# Altium project 16SoundsUSB.PrjPCB (part 1 of 2)
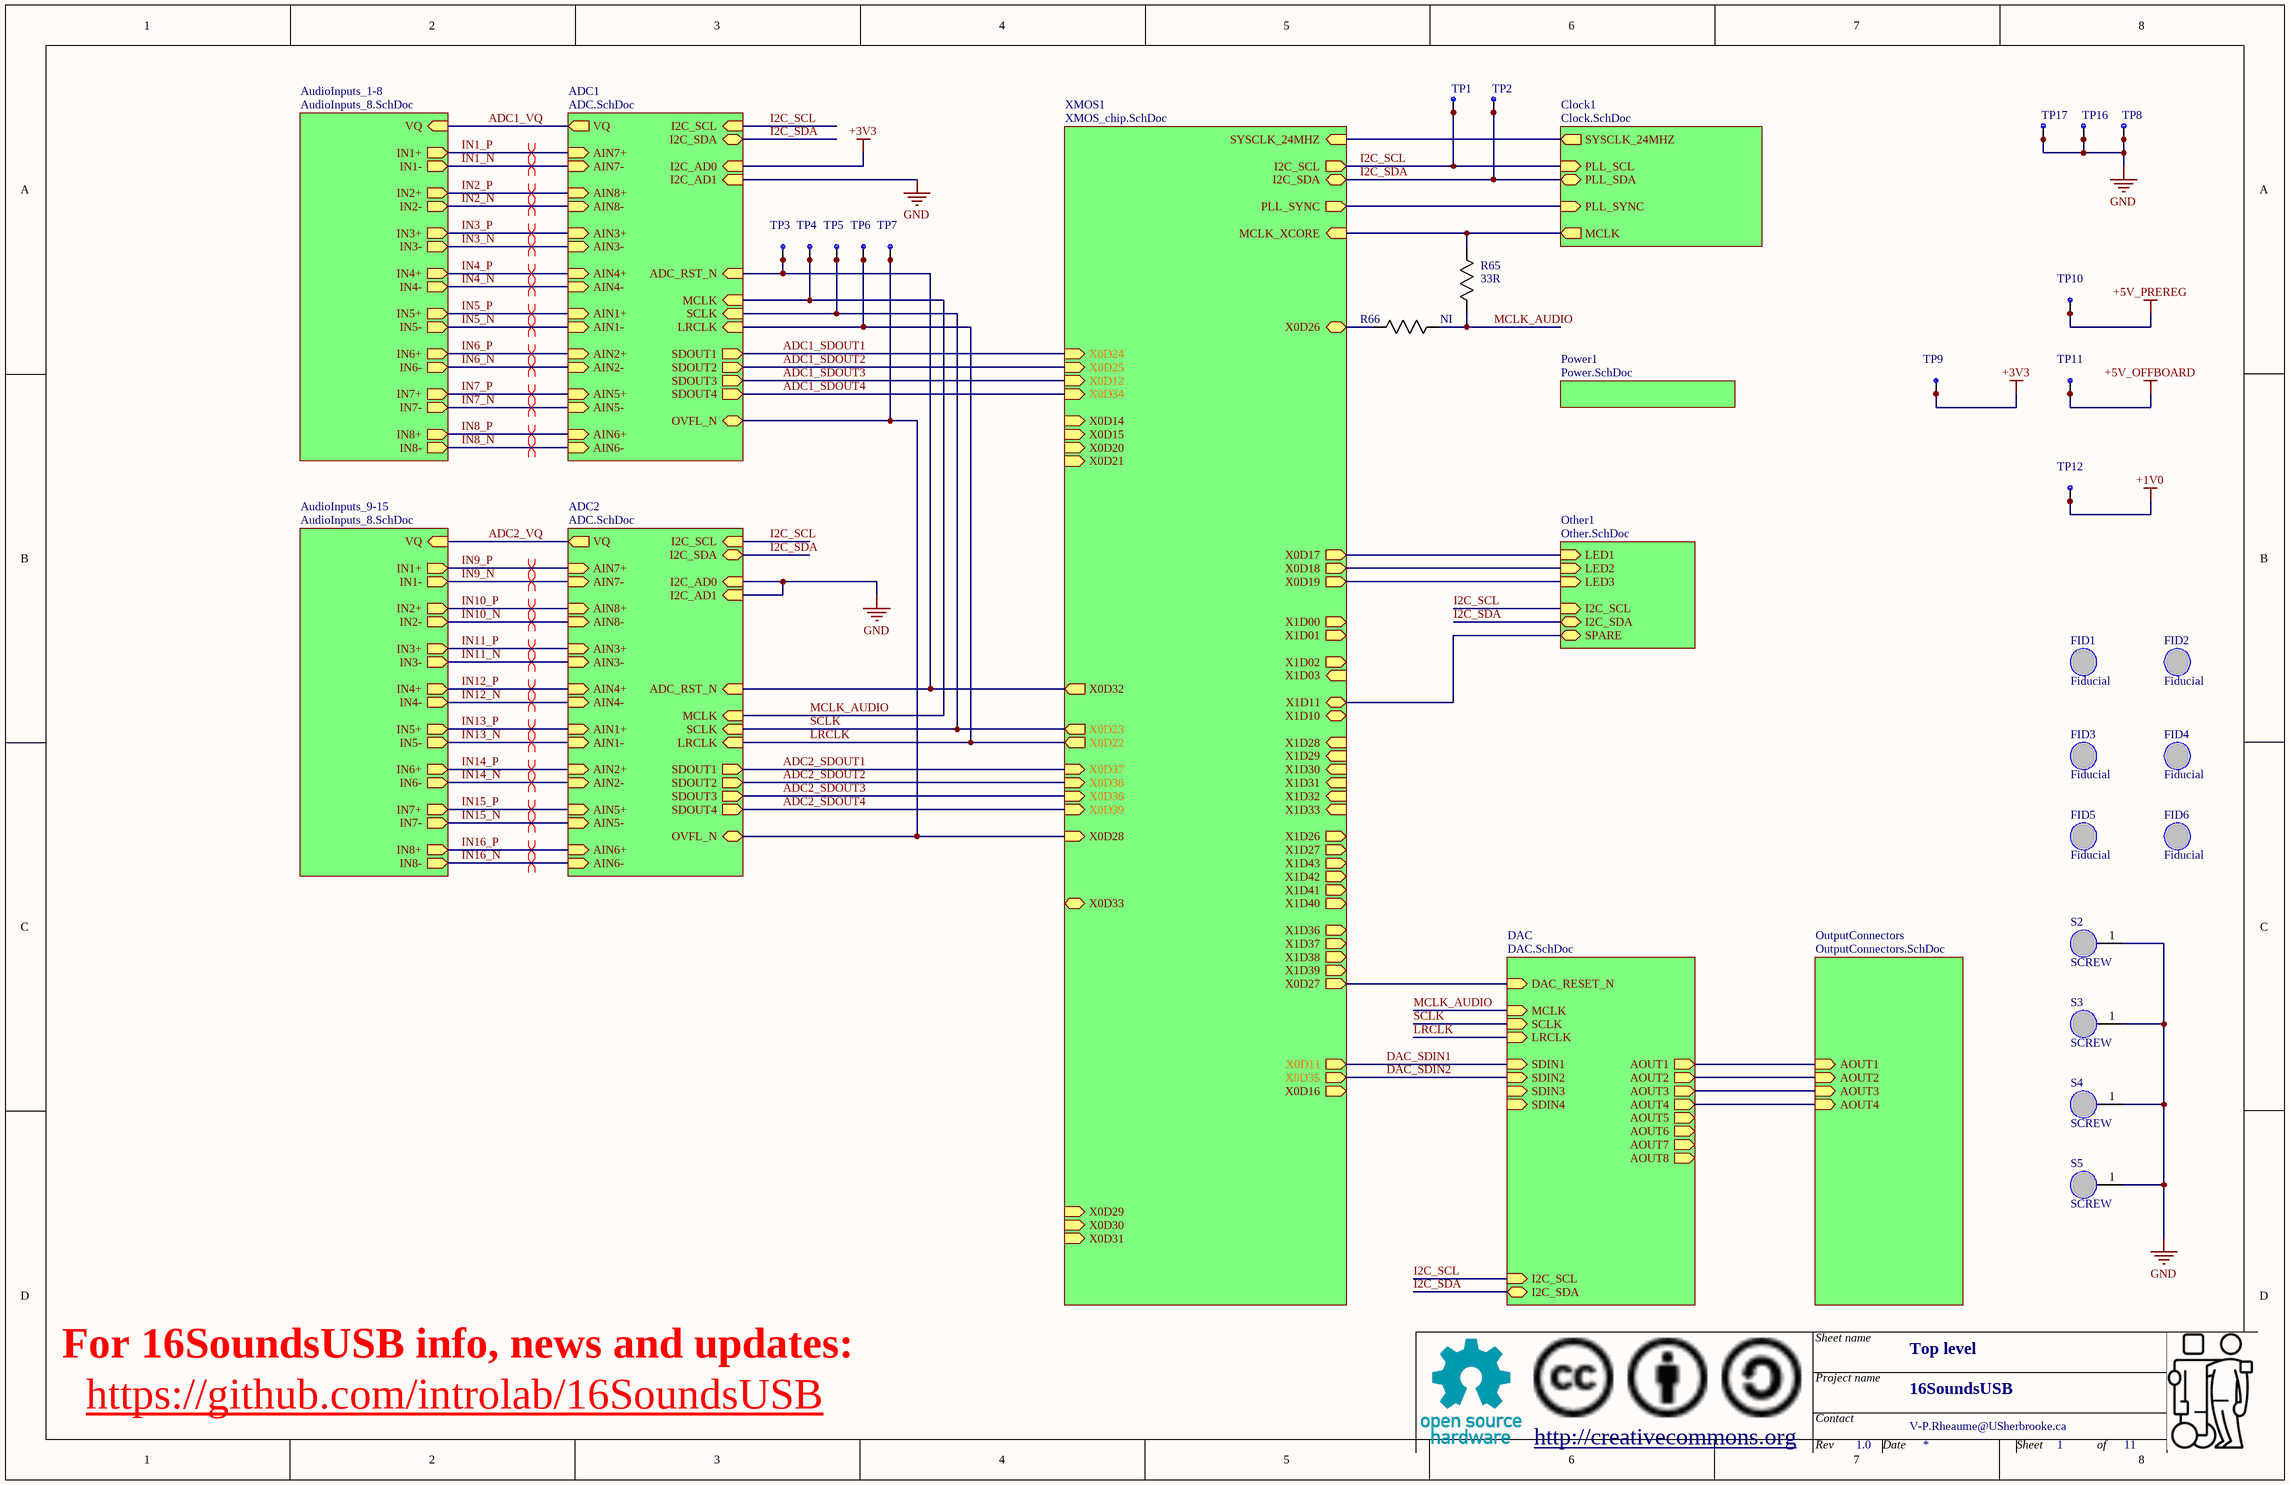
[diagram p0: TopLevel.SchDoc]
DrawnByGlobal: V-P.Rheaume@USherbrooke.ca; ProjectTitle: 16SoundsUSB; RevisionGlobal: 1.0
9 sheets, 530 parts. Net scope: hierarchical (ports join the sheet entries above them; power ports are global).
Board file: PCB3.PcbDoc
Sheets:
  TopLevel.SchDoc
    AudioInputs_9-15 = AudioInputs_8.SchDoc
      InputAmplifier1 = InputAmplifier.SchDoc
      InputAmplifier2 = InputAmplifier.SchDoc
      InputAmplifier3 = InputAmplifier.SchDoc
      InputAmplifier4 = InputAmplifier.SchDoc
      InputAmplifier5 = InputAmplifier.SchDoc
      InputAmplifier6 = InputAmplifier.SchDoc
      InputAmplifier7 = InputAmplifier.SchDoc
      InputAmplifier8 = InputAmplifier.SchDoc
    Clock1 = Clock.SchDoc
    AudioInputs_1-8 = AudioInputs_8.SchDoc
      InputAmplifier1 = InputAmplifier.SchDoc
      InputAmplifier2 = InputAmplifier.SchDoc
      InputAmplifier3 = InputAmplifier.SchDoc
      InputAmplifier4 = InputAmplifier.SchDoc
      InputAmplifier5 = InputAmplifier.SchDoc
      InputAmplifier6 = InputAmplifier.SchDoc
      InputAmplifier7 = InputAmplifier.SchDoc
      InputAmplifier8 = InputAmplifier.SchDoc
    ADC2 = ADC.SchDoc
    ADC1 = ADC.SchDoc
    DAC = DAC.SchDoc
    OutputConnectors = OutputConnectors.SchDoc
    Other1 = Other.SchDoc
  XMOS_power.SchDoc

## Sheet TopLevel.SchDoc
size Tabloid; DrawnBy: V-P.Rheaume@USherbrooke.ca; DocumentNumber: 1; Revision: 1; SheetNumber: 1; SheetTotal: 11; SheetName: Top level

### Parts
FID1  Fiducial  [FIDUCIAL]
FID2  Fiducial  [FIDUCIAL]
FID3  Fiducial  [FIDUCIAL]
FID4  Fiducial  [FIDUCIAL]
FID5  Fiducial  [FIDUCIAL]
FID6  Fiducial  [FIDUCIAL]
R65  value 33R  [0603]  (hidden comment: Resistor)
R66  Resistor  [0603]  (value not drawn)
S2  SCREW  [SCREW_4_40]
S3  SCREW  [SCREW_4_40]
S4  SCREW  [SCREW_4_40]
S5  SCREW  [SCREW_4_40]
TP1  TESTPOINT  [0603]  (value not drawn)
TP2  TESTPOINT  [0603]  (value not drawn)
TP3  TESTPOINT  [0603]  (value not drawn)
TP4  TESTPOINT  [0603]  (value not drawn)
TP5  TESTPOINT  [0603]  (value not drawn)
TP6  TESTPOINT  [0603]  (value not drawn)
TP7  TESTPOINT  [0603]  (value not drawn)
TP8  TESTPOINT  [1206]  (value not drawn)
TP9  TESTPOINT  [0603]  (value not drawn)
TP10  TESTPOINT  [0603]  (value not drawn)
TP11  TESTPOINT  [0603]  (value not drawn)
TP12  TESTPOINT  [0603]  (value not drawn)
TP16  TESTPOINT  [1206]  (value not drawn)
TP17  TESTPOINT  [1206]  (value not drawn)

### Sub-sheets
ADC1 = ADC.SchDoc: I2C_SCL (in), I2C_SDA (bidir), I2C_AD1 (in), I2C_AD0 (in), SDOUT1 (out), SDOUT2 (out), SDOUT3 (out), SDOUT4 (out), LRCLK (in), SCLK (in), MCLK (in), ADC_RST_N (in), OVFL_N (bidir), AIN1+ (in), AIN1- (in), AIN2+ (in), AIN2- (in), AIN3+ (in), AIN3- (in), AIN4+ (in), AIN4- (in), AIN5+ (in), AIN5- (in), AIN6+ (in), AIN6- (in), AIN7+ (in), AIN7- (in), AIN8+ (in), AIN8- (in), VQ (out)
ADC2 = ADC.SchDoc: I2C_SCL (in), I2C_SDA (bidir), I2C_AD1 (in), I2C_AD0 (in), SDOUT1 (out), SDOUT2 (out), SDOUT3 (out), SDOUT4 (out), LRCLK (in), SCLK (in), MCLK (in), ADC_RST_N (in), OVFL_N (bidir), AIN1+ (in), AIN1- (in), AIN2+ (in), AIN2- (in), AIN3+ (in), AIN3- (in), AIN4+ (in), AIN4- (in), AIN5+ (in), AIN5- (in), AIN6+ (in), AIN6- (in), AIN7+ (in), AIN7- (in), AIN8+ (in), AIN8- (in), VQ (out)
AudioInputs_1-8 = AudioInputs_8.SchDoc: VQ (in), IN8+ (out), IN8- (out), IN1+ (out), IN1- (out), IN2+ (out), IN2- (out), IN3+ (out), IN3- (out), IN4+ (out), IN4- (out), IN5+ (out), IN5- (out), IN6+ (out), IN6- (out), IN7+ (out), IN7- (out)
AudioInputs_9-15 = AudioInputs_8.SchDoc: VQ (in), IN8+ (out), IN8- (out), IN1+ (out), IN1- (out), IN2+ (out), IN2- (out), IN3+ (out), IN3- (out), IN4+ (out), IN4- (out), IN5+ (out), IN5- (out), IN6+ (out), IN6- (out), IN7+ (out), IN7- (out)
Clock1 = Clock.SchDoc: SYSCLK_24MHZ (out), PLL_SYNC (in), PLL_SCL (in), PLL_SDA (bidir), MCLK (out)
DAC = DAC.SchDoc: LRCLK (in), SCLK (in), MCLK (in), SDIN1 (in), SDIN2 (in), SDIN3 (in), SDIN4 (in), DAC_RESET_N (in), I2C_SCL (in), I2C_SDA (bidir), AOUT1 (out), AOUT2 (out), AOUT3 (out), AOUT4 (out), AOUT5 (out), AOUT6 (out), AOUT7 (out), AOUT8 (out)
Other1 = Other.SchDoc: LED1 (in), LED2 (in), LED3 (in), I2C_SCL (in), I2C_SDA (bidir), SPARE (bidir)
OutputConnectors = OutputConnectors.SchDoc: AOUT1 (in), AOUT2 (in), AOUT3 (in), AOUT4 (in)
Power1 = Power.SchDoc (file not in this document): no entries
XMOS1 = XMOS_chip.SchDoc (file not in this document): SYSCLK_24MHZ (in), MCLK_XCORE (in), I2C_SCL (out), I2C_SDA (bidir), PLL_SYNC (out), X0D14 (in), X0D15 (in), X0D16 (out), X0D17 (out), X0D18 (out), X0D19 (out), X0D20 (in), X0D21 (in), X0D22 (out), X0D23 (out), X0D24 (in), X0D25 (in), X0D27 (out), X0D32 (out), X0D34 (in), X0D35 (out), X0D36 (in), X0D37 (in), X0D38 (in), X0D39 (in), X0D29 (in), X0D28 (in), X0D31 (in), X0D30 (in), X0D33 (bidir), X0D26 (bidir), X1D26 (out), X1D27 (out), X1D28 (in), X1D29 (in), X1D30 (in), X1D31 (in), X1D32 (in), X1D33 (in), X1D43 (out), X1D42 (out), X1D41 (out), X1D40 (out), X1D10 (bidir), X1D11 (bidir), X1D03 (in), X1D02 (out), X1D01 (out), X1D00 (out), X1D37 (out), X1D36 (out), X1D39 (out), X1D38 (out), X0D12 (in), X0D11 (out)

### Nets
+1V0: TP12.1 TP12.2
+3V3: TP9.1 TP9.2 ; sheet ADC1/I2C_AD0
+5V_OFFBOARD: TP11.1 TP11.2
+5V_PREREG: TP10.1 TP10.2
GND: S2.1 S3.1 S4.1 S5.1 TP8.1 TP8.2 TP16.1 TP16.2 TP17.1 TP17.2 ; sheet ADC2/I2C_AD1, sheet ADC2/I2C_AD0, sheet ADC1/I2C_AD1
ADC1_SDOUT1: sheet XMOS1/X0D24, sheet ADC1/SDOUT1
ADC1_SDOUT2: sheet XMOS1/X0D25, sheet ADC1/SDOUT2
ADC1_SDOUT3: sheet XMOS1/X0D12, sheet ADC1/SDOUT3
ADC1_SDOUT4: sheet XMOS1/X0D34, sheet ADC1/SDOUT4
ADC1_VQ: sheet AudioInputs_1-8/VQ, sheet ADC1/VQ
ADC2_SDOUT1: sheet XMOS1/X0D37, sheet ADC2/SDOUT1
ADC2_SDOUT2: sheet XMOS1/X0D38, sheet ADC2/SDOUT2
ADC2_SDOUT3: sheet XMOS1/X0D36, sheet ADC2/SDOUT3
ADC2_SDOUT4: sheet XMOS1/X0D39, sheet ADC2/SDOUT4
ADC2_VQ: sheet AudioInputs_9-15/VQ, sheet ADC2/VQ
DAC_SDIN1: sheet XMOS1/X0D11, sheet DAC/SDIN1
DAC_SDIN2: sheet XMOS1/X0D35, sheet DAC/SDIN2
I2C_SCL: TP1.1 TP1.2 ; sheet XMOS1/I2C_SCL, sheet Clock1/PLL_SCL, sheet ADC2/I2C_SCL, sheet ADC1/I2C_SCL, sheet DAC/I2C_SCL, sheet Other1/I2C_SCL
I2C_SDA: TP2.1 TP2.2 ; sheet XMOS1/I2C_SDA, sheet Clock1/PLL_SDA, sheet ADC2/I2C_SDA, sheet ADC1/I2C_SDA, sheet DAC/I2C_SDA, sheet Other1/I2C_SDA
IN1_N: sheet AudioInputs_1-8/IN1-, sheet ADC1/AIN7-
IN1_P: sheet AudioInputs_1-8/IN1+, sheet ADC1/AIN7+
IN2_N: sheet AudioInputs_1-8/IN2-, sheet ADC1/AIN8-
IN2_P: sheet AudioInputs_1-8/IN2+, sheet ADC1/AIN8+
IN3_N: sheet AudioInputs_1-8/IN3-, sheet ADC1/AIN3-
IN3_P: sheet AudioInputs_1-8/IN3+, sheet ADC1/AIN3+
IN4_N: sheet AudioInputs_1-8/IN4-, sheet ADC1/AIN4-
IN4_P: sheet AudioInputs_1-8/IN4+, sheet ADC1/AIN4+
IN5_N: sheet AudioInputs_1-8/IN5-, sheet ADC1/AIN1-
IN5_P: sheet AudioInputs_1-8/IN5+, sheet ADC1/AIN1+
IN6_N: sheet AudioInputs_1-8/IN6-, sheet ADC1/AIN2-
IN6_P: sheet AudioInputs_1-8/IN6+, sheet ADC1/AIN2+
IN7_N: sheet AudioInputs_1-8/IN7-, sheet ADC1/AIN5-
IN7_P: sheet AudioInputs_1-8/IN7+, sheet ADC1/AIN5+
IN8_N: sheet AudioInputs_1-8/IN8-, sheet ADC1/AIN6-
IN8_P: sheet AudioInputs_1-8/IN8+, sheet ADC1/AIN6+
IN9_N: sheet AudioInputs_9-15/IN1-, sheet ADC2/AIN7-
IN9_P: sheet AudioInputs_9-15/IN1+, sheet ADC2/AIN7+
IN10_N: sheet AudioInputs_9-15/IN2-, sheet ADC2/AIN8-
IN10_P: sheet AudioInputs_9-15/IN2+, sheet ADC2/AIN8+
IN11_N: sheet AudioInputs_9-15/IN3-, sheet ADC2/AIN3-
IN11_P: sheet AudioInputs_9-15/IN3+, sheet ADC2/AIN3+
IN12_N: sheet AudioInputs_9-15/IN4-, sheet ADC2/AIN4-
IN12_P: sheet AudioInputs_9-15/IN4+, sheet ADC2/AIN4+
IN13_N: sheet AudioInputs_9-15/IN5-, sheet ADC2/AIN1-
IN13_P: sheet AudioInputs_9-15/IN5+, sheet ADC2/AIN1+
IN14_N: sheet AudioInputs_9-15/IN6-, sheet ADC2/AIN2-
IN14_P: sheet AudioInputs_9-15/IN6+, sheet ADC2/AIN2+
IN15_N: sheet AudioInputs_9-15/IN7-, sheet ADC2/AIN5-
IN15_P: sheet AudioInputs_9-15/IN7+, sheet ADC2/AIN5+
IN16_N: sheet AudioInputs_9-15/IN8-, sheet ADC2/AIN6-
IN16_P: sheet AudioInputs_9-15/IN8+, sheet ADC2/AIN6+
LRCLK: TP6.1 TP6.2 ; sheet XMOS1/X0D22, sheet ADC2/LRCLK, sheet ADC1/LRCLK, sheet DAC/LRCLK
MCLK_AUDIO: R65.1 R66.2 TP4.1 TP4.2 ; sheet ADC2/MCLK, sheet ADC1/MCLK, sheet DAC/MCLK
SCLK: TP5.1 TP5.2 ; sheet XMOS1/X0D23, sheet ADC2/SCLK, sheet ADC1/SCLK, sheet DAC/SCLK
NetC36_+: sheet DAC/AOUT1, sheet OutputConnectors/AOUT1
NetC37_+: sheet DAC/AOUT3, sheet OutputConnectors/AOUT3
NetC40_+: sheet DAC/AOUT2, sheet OutputConnectors/AOUT2
NetC41_+: sheet DAC/AOUT4, sheet OutputConnectors/AOUT4
NetP19_5: sheet XMOS1/X1D11, sheet Other1/SPARE
NetR2_2: R65.2 ; sheet XMOS1/MCLK_XCORE, sheet Clock1/MCLK
NetR7_ADC1_2: TP7.1 TP7.2 ; sheet XMOS1/X0D28, sheet ADC2/OVFL_N, sheet ADC1/OVFL_N
NetR8_1: sheet XMOS1/X0D19, sheet Other1/LED3
NetR10_1: sheet XMOS1/X0D18, sheet Other1/LED2
NetR17_2: sheet XMOS1/SYSCLK_24MHZ, sheet Clock1/SYSCLK_24MHZ
NetR45_1: sheet XMOS1/X0D17, sheet Other1/LED1
NetR66_1: R66.1 ; sheet XMOS1/X0D26
NetTP3_1: TP3.1 TP3.2 ; sheet XMOS1/X0D32, sheet ADC2/ADC_RST_N, sheet ADC1/ADC_RST_N
NetU2_5: sheet XMOS1/PLL_SYNC, sheet Clock1/PLL_SYNC
NetU17_19: sheet XMOS1/X0D27, sheet DAC/DAC_RESET_N

Not connected (* = marked no-connect by the designer): FID1 0; FID2 0; FID3 0; FID4 0; FID5 0; FID6 0

### Layout directives
differential pair: IN1_N, IN1_P, IN2_N, IN2_P, IN3_N, IN3_P, IN4_N, IN4_P, IN5_N, IN5_P, IN6_N, IN6_P, IN7_N, IN7_P, IN8_N, IN8_P, IN9_N, IN9_P, IN10_N, IN10_P, IN11_N, IN11_P, IN12_N, IN12_P, IN13_N, IN13_P, IN14_N, IN14_P, IN15_N, IN15_P, IN16_N, IN16_P

### Notes on the sheet
- For 16SoundsUSB info, news and updates:
- https://github.com/introlab/16SoundsUSB
- Sheet name
- http://creativecommons.org
- Project name
- Contact
- Rev
- Date
- Sheet
- of

### Library data of the parts
R66 = Resistor: Value: 33R; HelpURL: *; Mfg: *; Mfg_PN: *; NI: NI; Supplier1: *; Supplier1_PN: *; Type: *; Rating: *; Tolerance: *
S2-S5 = SCREW: Screw hole; HelpURL: *; Mfg: *; Mfg_PN: *; NI: NI; Rating: *; Supplier1: *; Supplier1_PN: *; Tolerance: *; Type: *; Value: *
TP1-TP7 TP9-TP12 = TESTPOINT: Test point; Mfg: TE; Mfg_PN: RCU-0C; HelpURL: *; NI: *; Rating: *; Supplier1: Digikey; Supplier1_PN: A106145CT-ND; Tolerance: *; Type: *; Value: *
TP8 TP16 TP17 = TESTPOINT: Test point; Mfg: Harwin; Mfg_PN: S1751-46; HelpURL: *; NI: *; Rating: *; Supplier1: Digikey; Supplier1_PN: 952-3024-ND; Tolerance: *; Type: *; Value: *
FID1-FID6 = Fiducial: HelpURL: *; Mfg: *; Mfg_PN: *; NI: NI; Rating: *; Supplier1: *; Supplier1_PN: *; Tolerance: *; Type: *; Value: *
R65 = Resistor: HelpURL: *; Mfg: *; Mfg_PN: *; NI: *; Supplier1: *; Supplier1_PN: *; Type: *; Rating: *; Tolerance: *

## Sheet AudioInputs_8.SchDoc
size Tabloid; DocumentNumber: 10; SheetNumber: 10; SheetTotal: 11; SheetName: Analog input (group)
Used 2 times, as channels AudioInputs_9-15, AudioInputs_1-8. Parts and nets are listed once, with the designators drawn on the sheet.
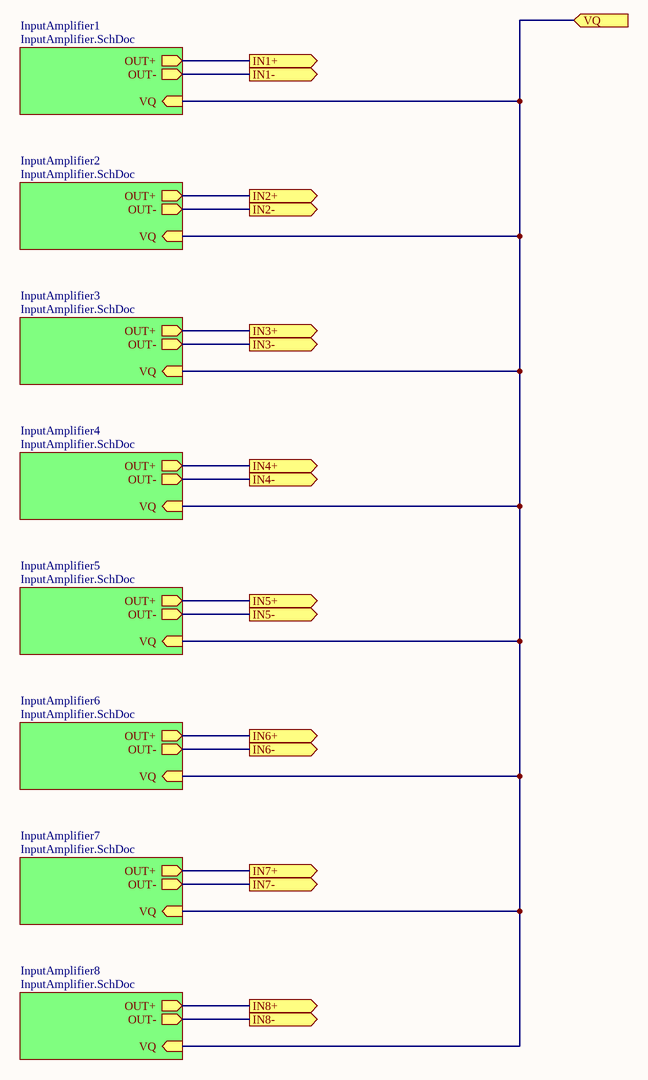
[diagram p1: AudioInputs_8.SchDoc]

### Sub-sheets
InputAmplifier1 = InputAmplifier.SchDoc: VQ (in), OUT+ (out), OUT- (out)
InputAmplifier2 = InputAmplifier.SchDoc: VQ (in), OUT+ (out), OUT- (out)
InputAmplifier3 = InputAmplifier.SchDoc: VQ (in), OUT+ (out), OUT- (out)
InputAmplifier4 = InputAmplifier.SchDoc: VQ (in), OUT+ (out), OUT- (out)
InputAmplifier5 = InputAmplifier.SchDoc: VQ (in), OUT+ (out), OUT- (out)
InputAmplifier6 = InputAmplifier.SchDoc: VQ (in), OUT+ (out), OUT- (out)
InputAmplifier7 = InputAmplifier.SchDoc: VQ (in), OUT+ (out), OUT- (out)
InputAmplifier8 = InputAmplifier.SchDoc: VQ (in), OUT+ (out), OUT- (out)

### Ports
IN1+ (out), IN1- (out), IN2+ (out), IN2- (out), IN3+ (out), IN3- (out), IN4+ (out), IN4- (out), IN5+ (out), IN5- (out), IN6+ (out), IN6- (out), IN7+ (out), IN7- (out), IN8+ (out), IN8- (out), VQ (in)

### Nets
IN1+: port IN1+, sheet InputAmplifier1/OUT+
IN1-: port IN1-, sheet InputAmplifier1/OUT-
IN2+: port IN2+, sheet InputAmplifier2/OUT+
IN2-: port IN2-, sheet InputAmplifier2/OUT-
IN3+: port IN3+, sheet InputAmplifier3/OUT+
IN3-: port IN3-, sheet InputAmplifier3/OUT-
IN4+: port IN4+, sheet InputAmplifier4/OUT+
IN4-: port IN4-, sheet InputAmplifier4/OUT-
IN5+: port IN5+, sheet InputAmplifier5/OUT+
IN5-: port IN5-, sheet InputAmplifier5/OUT-
IN6+: port IN6+, sheet InputAmplifier6/OUT+
IN6-: port IN6-, sheet InputAmplifier6/OUT-
IN7+: port IN7+, sheet InputAmplifier7/OUT+
IN7-: port IN7-, sheet InputAmplifier7/OUT-
IN8+: port IN8+, sheet InputAmplifier8/OUT+
IN8-: port IN8-, sheet InputAmplifier8/OUT-
VQ: port VQ, sheet InputAmplifier1/VQ, sheet InputAmplifier2/VQ, sheet InputAmplifier3/VQ, sheet InputAmplifier4/VQ, sheet InputAmplifier5/VQ, sheet InputAmplifier6/VQ, sheet InputAmplifier7/VQ, sheet InputAmplifier8/VQ

### Channels
AudioInputs_9-15: ports IN1+=IN9_P IN1-=IN9_N IN2+=IN10_P IN2-=IN10_N IN3+=IN11_P IN3-=IN11_N IN4+=IN12_P IN4-=IN12_N IN5+=IN13_P IN5-=IN13_N IN6+=IN14_P IN6-=IN14_N IN7+=IN15_P IN7-=IN15_N IN8+=IN16_P IN8-=IN16_N VQ=ADC2_VQ
AudioInputs_1-8: ports IN1+=IN1_P IN1-=IN1_N IN2+=IN2_P IN2-=IN2_N IN3+=IN3_P IN3-=IN3_N IN4+=IN4_P IN4-=IN4_N IN5+=IN5_P IN5-=IN5_N IN6+=IN6_P IN6-=IN6_N IN7+=IN7_P IN7-=IN7_N IN8+=IN8_P IN8-=IN8_N VQ=ADC1_VQ

### Notes on the sheet
- Sheet name
- http://creativecommons.org
- Project name
- Contact
- Rev
- Date
- Sheet
- of

## Sheet InputAmplifier.SchDoc
size Tabloid; DocumentNumber: 11; SheetNumber: 11; SheetTotal: 11; SheetName: Audio input amplifier
Used 16 times, as channels AudioInputs_9-15/InputAmplifier1, AudioInputs_9-15/InputAmplifier2, AudioInputs_9-15/InputAmplifier3, AudioInputs_9-15/InputAmplifier4, AudioInputs_9-15/InputAmplifier5, AudioInputs_9-15/InputAmplifier6, AudioInputs_9-15/InputAmplifier7, AudioInputs_9-15/InputAmplifier8, AudioInputs_1-8/InputAmplifier1, AudioInputs_1-8/InputAmplifier2, AudioInputs_1-8/InputAmplifier3, AudioInputs_1-8/InputAmplifier4, AudioInputs_1-8/InputAmplifier5, AudioInputs_1-8/InputAmplifier6, AudioInputs_1-8/InputAmplifier7, AudioInputs_1-8/InputAmplifier8. Parts and nets are listed once, with the designators drawn on the sheet.
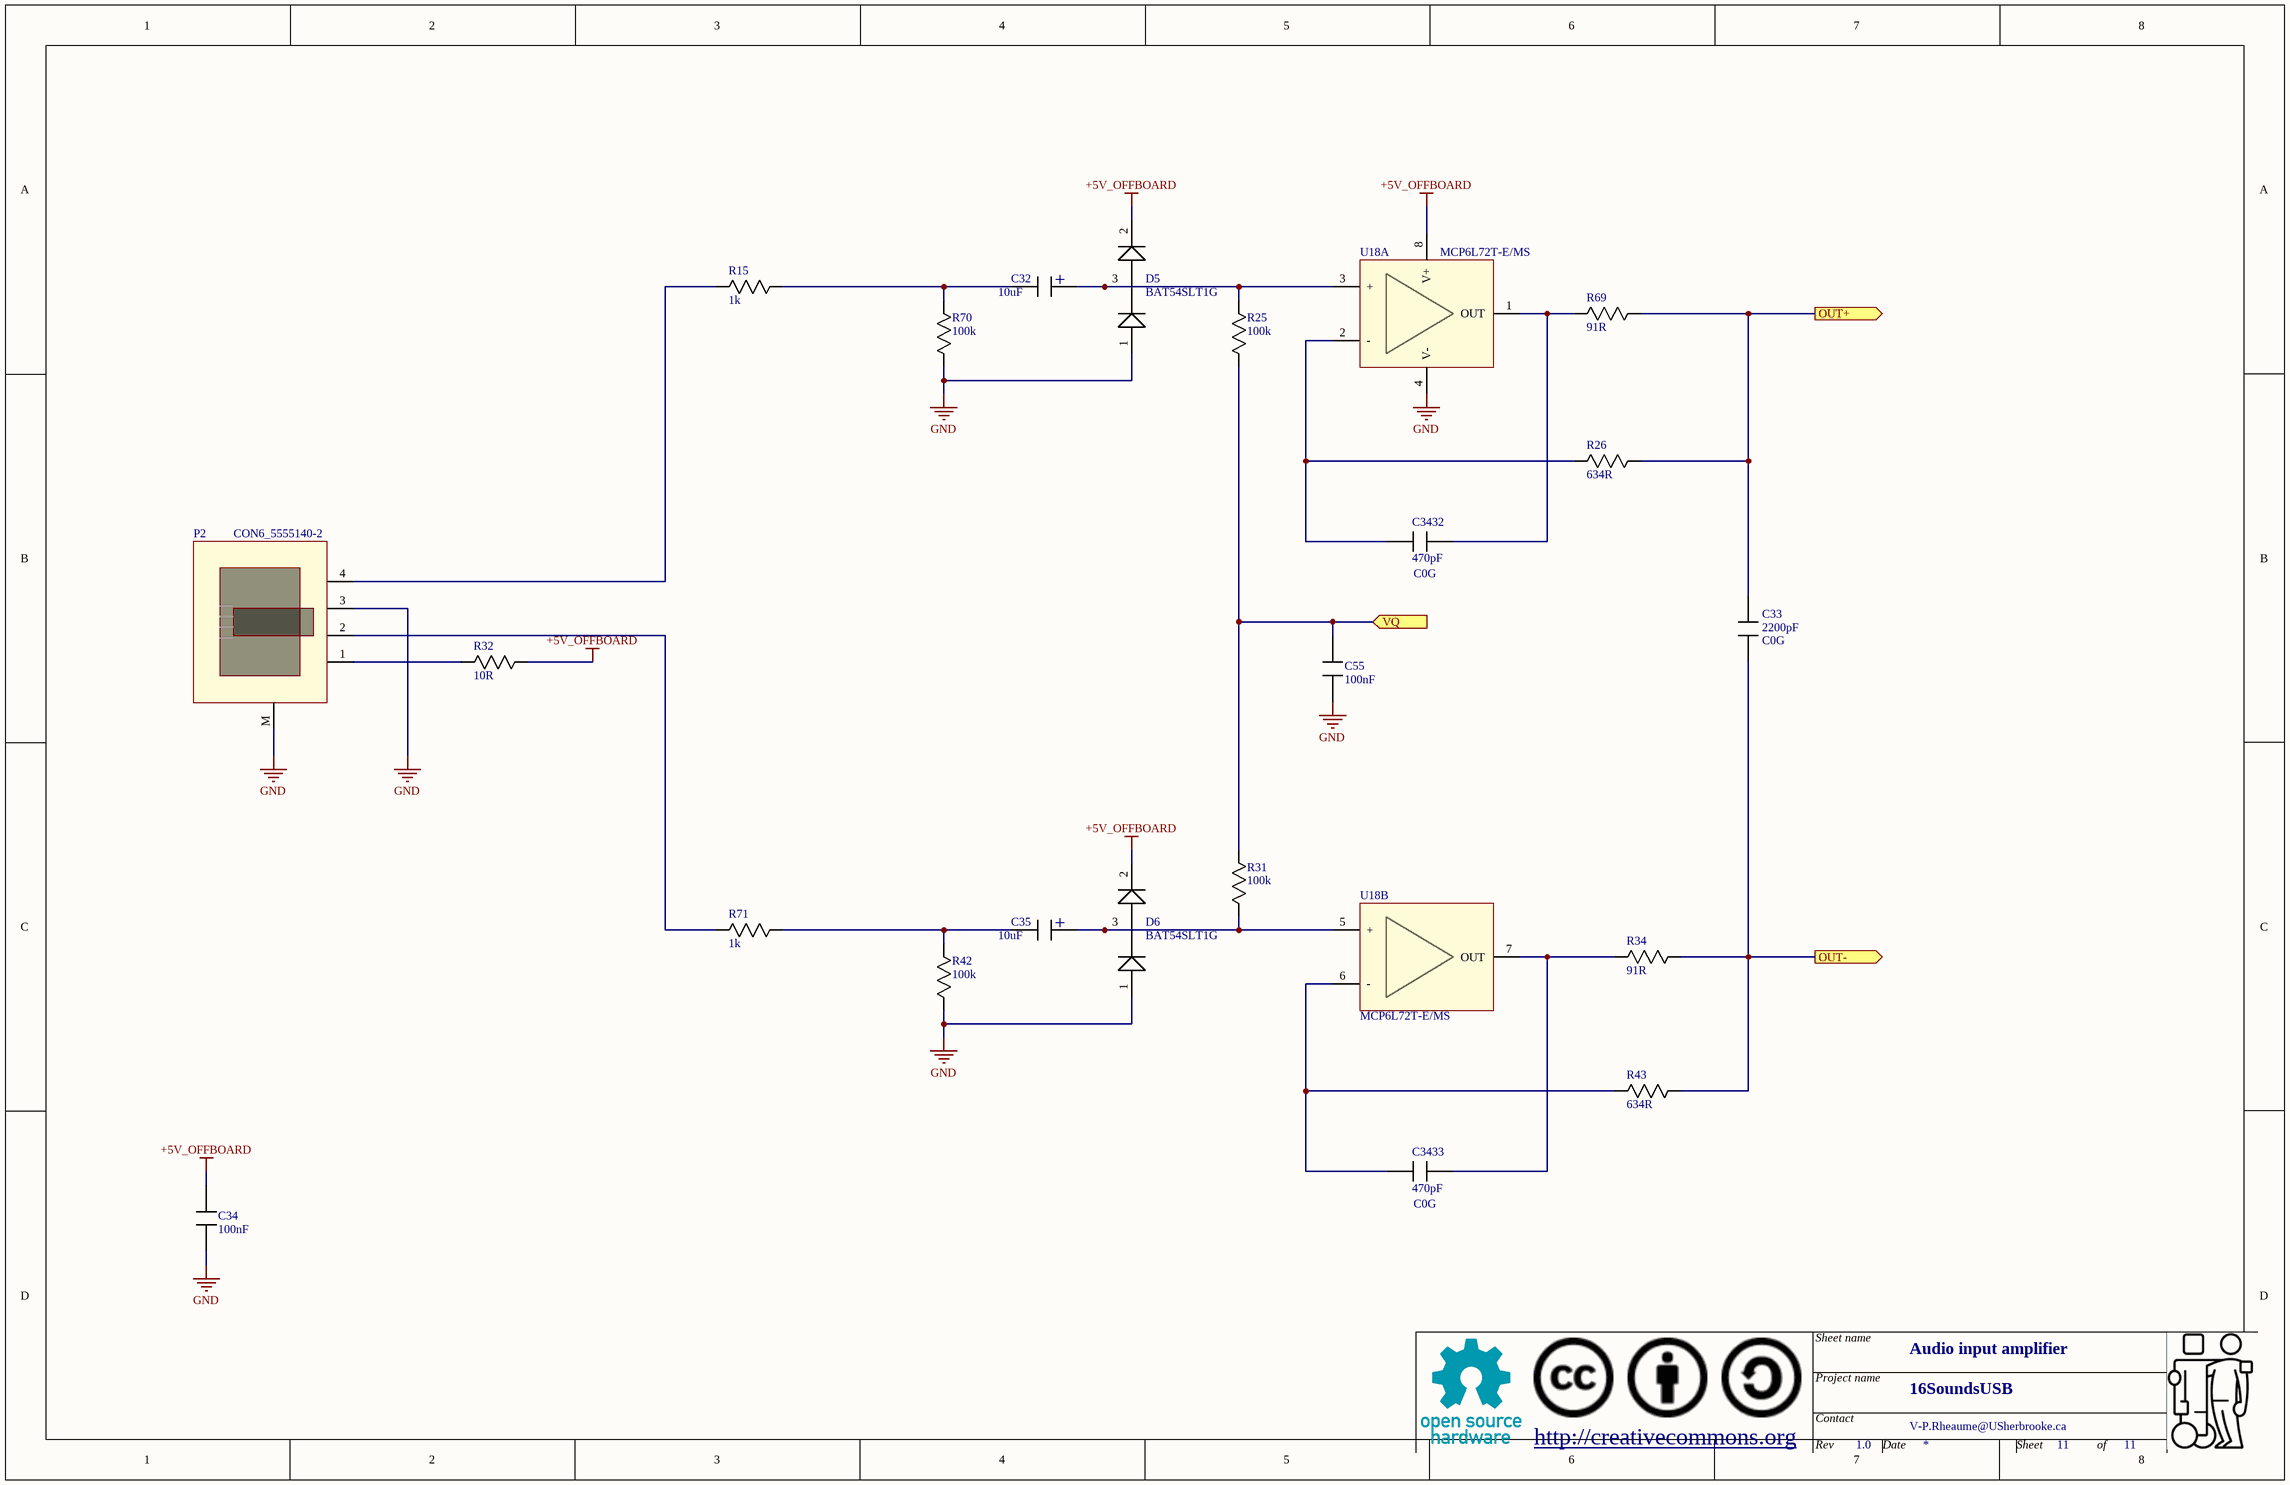
[diagram p2: InputAmplifier.SchDoc]

### Parts
C32  value 10uF  [CAP_RAD_SMD_DIA157]  (hidden comment: Capacitor_Polarized)
C33  value 2200pF  Type: C0G  [0603]  (hidden comment: Capacitor)
C34  value 100nF  [0603]  (hidden comment: Capacitor)
C35  value 10uF  [CAP_RAD_SMD_DIA157]  (hidden comment: Capacitor_Polarized)
C55  value 100nF  [0603]  (hidden comment: Capacitor)
C3432  value 470pF  Type: C0G  [0603]  (hidden comment: Capacitor)
C3433  value 470pF  Type: C0G  [0603]  (hidden comment: Capacitor)
D5  Mfg_PN: BAT54SLT1G  [SOT23_132]  (hidden comment: Diode_dual)
D6  Mfg_PN: BAT54SLT1G  [SOT23_132]  (hidden comment: Diode_dual)
P2  CON6_5555140-2  [CONN4_5555140-2]
R15  value 1k  [0603]  (hidden comment: Resistor)
R25  value 100k  [0603]  (hidden comment: Resistor)
R26  value 634R  [0603]  (hidden comment: Resistor)
R31  value 100k  [0603]  (hidden comment: Resistor)
R32  value 10R  [0603]  (hidden comment: Resistor)
R34  value 91R  [0603]  (hidden comment: Resistor)
R42  value 100k  [0603]  (hidden comment: Resistor)
R43  value 634R  [0603]  (hidden comment: Resistor)
R69  value 91R  [0603]  (hidden comment: Resistor)
R70  value 100k  [0603]  (hidden comment: Resistor)
R71  value 1k  [0603]  (hidden comment: Resistor)
U18  Mfg_PN: MCP6L72T-E/MS  [SOP127P600-8N]  (hidden comment: OPA_DUAL)  (parts A,B of 2)

### Ports
OUT+ (out), OUT- (out), VQ (in)

### Nets
+5V_OFFBOARD: C34.1 D5.2(K) D6.2(K) R32.2 U18.8(V+)
GND: C34.2 C55.2 D5.1(K) D6.1(K) P2.3 P2.M R42.1 R70.1 U18.4(V-)
OUT+: C33.1 R26.2 R69.2 ; port OUT+
OUT-: C33.2 R34.2 R43.2 ; port OUT-
VQ: C55.1 R25.1 R31.2 ; port VQ
NetC32_+: C32.+ D5.3(AK) R25.2 U18.3(+)
NetC32_-: C32.- R15.2 R70.2
NetC35_+: C35.+ D6.3(AK) R31.1 U18.5(+)
NetC35_-: C35.- R42.2 R71.2
NetC3432_1: C3432.1 R26.1 U18.2(-)
NetC3432_2: C3432.2 R69.1 U18.1(OUT)
NetC3433_1: C3433.1 R43.1 U18.6(-)
NetC3433_2: C3433.2 R34.1 U18.7(OUT)
NetP2_1: P2.1 R32.1
NetP2_2: P2.2 R71.1
NetP2_4: P2.4 R15.1

### Channels
AudioInputs_9-15/InputAmplifier1: designators end in _AudioInputs_9-15_InputAmplifier1; ports OUT+=IN9_P OUT-=IN9_N VQ=ADC2_VQ
AudioInputs_9-15/InputAmplifier2: designators end in _AudioInputs_9-15_InputAmplifier2; ports OUT+=IN10_P OUT-=IN10_N VQ=ADC2_VQ
AudioInputs_9-15/InputAmplifier3: designators end in _AudioInputs_9-15_InputAmplifier3; ports OUT+=IN11_P OUT-=IN11_N VQ=ADC2_VQ
AudioInputs_9-15/InputAmplifier4: designators end in _AudioInputs_9-15_InputAmplifier4; ports OUT+=IN12_P OUT-=IN12_N VQ=ADC2_VQ
AudioInputs_9-15/InputAmplifier5: designators end in _AudioInputs_9-15_InputAmplifier5; ports OUT+=IN13_P OUT-=IN13_N VQ=ADC2_VQ
AudioInputs_9-15/InputAmplifier6: designators end in _AudioInputs_9-15_InputAmplifier6; ports OUT+=IN14_P OUT-=IN14_N VQ=ADC2_VQ
AudioInputs_9-15/InputAmplifier7: designators end in _AudioInputs_9-15_InputAmplifier7; ports OUT+=IN15_P OUT-=IN15_N VQ=ADC2_VQ
AudioInputs_9-15/InputAmplifier8: designators end in _AudioInputs_9-15_InputAmplifier8; ports OUT+=IN16_P OUT-=IN16_N VQ=ADC2_VQ
AudioInputs_1-8/InputAmplifier1: designators end in _AudioInputs_1-8_InputAmplifier1; ports OUT+=IN1_P OUT-=IN1_N VQ=ADC1_VQ
AudioInputs_1-8/InputAmplifier2: designators end in _AudioInputs_1-8_InputAmplifier2; ports OUT+=IN2_P OUT-=IN2_N VQ=ADC1_VQ
AudioInputs_1-8/InputAmplifier3: designators end in _AudioInputs_1-8_InputAmplifier3; ports OUT+=IN3_P OUT-=IN3_N VQ=ADC1_VQ
AudioInputs_1-8/InputAmplifier4: designators end in _AudioInputs_1-8_InputAmplifier4; ports OUT+=IN4_P OUT-=IN4_N VQ=ADC1_VQ
AudioInputs_1-8/InputAmplifier5: designators end in _AudioInputs_1-8_InputAmplifier5; ports OUT+=IN5_P OUT-=IN5_N VQ=ADC1_VQ
AudioInputs_1-8/InputAmplifier6: designators end in _AudioInputs_1-8_InputAmplifier6; ports OUT+=IN6_P OUT-=IN6_N VQ=ADC1_VQ
AudioInputs_1-8/InputAmplifier7: designators end in _AudioInputs_1-8_InputAmplifier7; ports OUT+=IN7_P OUT-=IN7_N VQ=ADC1_VQ
AudioInputs_1-8/InputAmplifier8: designators end in _AudioInputs_1-8_InputAmplifier8; ports OUT+=IN8_P OUT-=IN8_N VQ=ADC1_VQ

### Notes on the sheet
- Sheet name
- http://creativecommons.org
- Project name
- Contact
- Rev
- Date
- Sheet
- of

### Library data of the parts
C32 C35 = Capacitor_Polarized: Capacitor; HelpURL: *; Mfg: *; Mfg_PN: *; NI: *; Supplier1: *; Supplier1_PN: *; Tolerance: *; Type: *; Rating: *
D5 D6 = Diode_dual: Diode; Mfg: Onsemi; HelpURL: *; NI: *; Supplier1: Digikey; Supplier1_PN: BAT54SLT1GOSCT-ND; Tolerance: *; Type: *; Rating: *; Value: *
P2 = CON6_5555140-2: 6p4c RJ11/RJ14, shielded (5555165-2 unshielded); Mfg: TE; HelpURL: *; Mfg_PN: 5555140-2; NI: *; Rating: *; Supplier1: Digikey; Supplier1_PN: A31436-ND; Tolerance: *; Type: *; Value: *
U18 = OPA_DUAL: Dual amplifier (standard); Mfg: Microchip; HelpURL: *; NI: *; Rating: *; Supplier1: Digikey; Supplier1_PN: MCP6L72T-E/MSCT-ND; Tolerance: *; Value: *
C33 C34 C55 C3432 C3433 = Capacitor: HelpURL: *; Mfg: *; Mfg_PN: *; NI: *; Supplier1: *; Supplier1_PN: *; Tolerance: *; Rating: *
  C34 C55: Type: *
R15 R25 R26 R31 R32 R34 R42 R43 R69-R71 = Resistor: HelpURL: *; Mfg: *; Mfg_PN: *; NI: *; Supplier1: *; Supplier1_PN: *; Type: *; Rating: *; Tolerance: *

## Sheet Clock.SchDoc
size Tabloid; DrawnBy: V-P.Rheaume@USherbrooke.ca; DocumentNumber: 4; SheetNumber: 4; SheetTotal: 11; SheetName: Clock; ProjectTitle: 16SoundsUSB
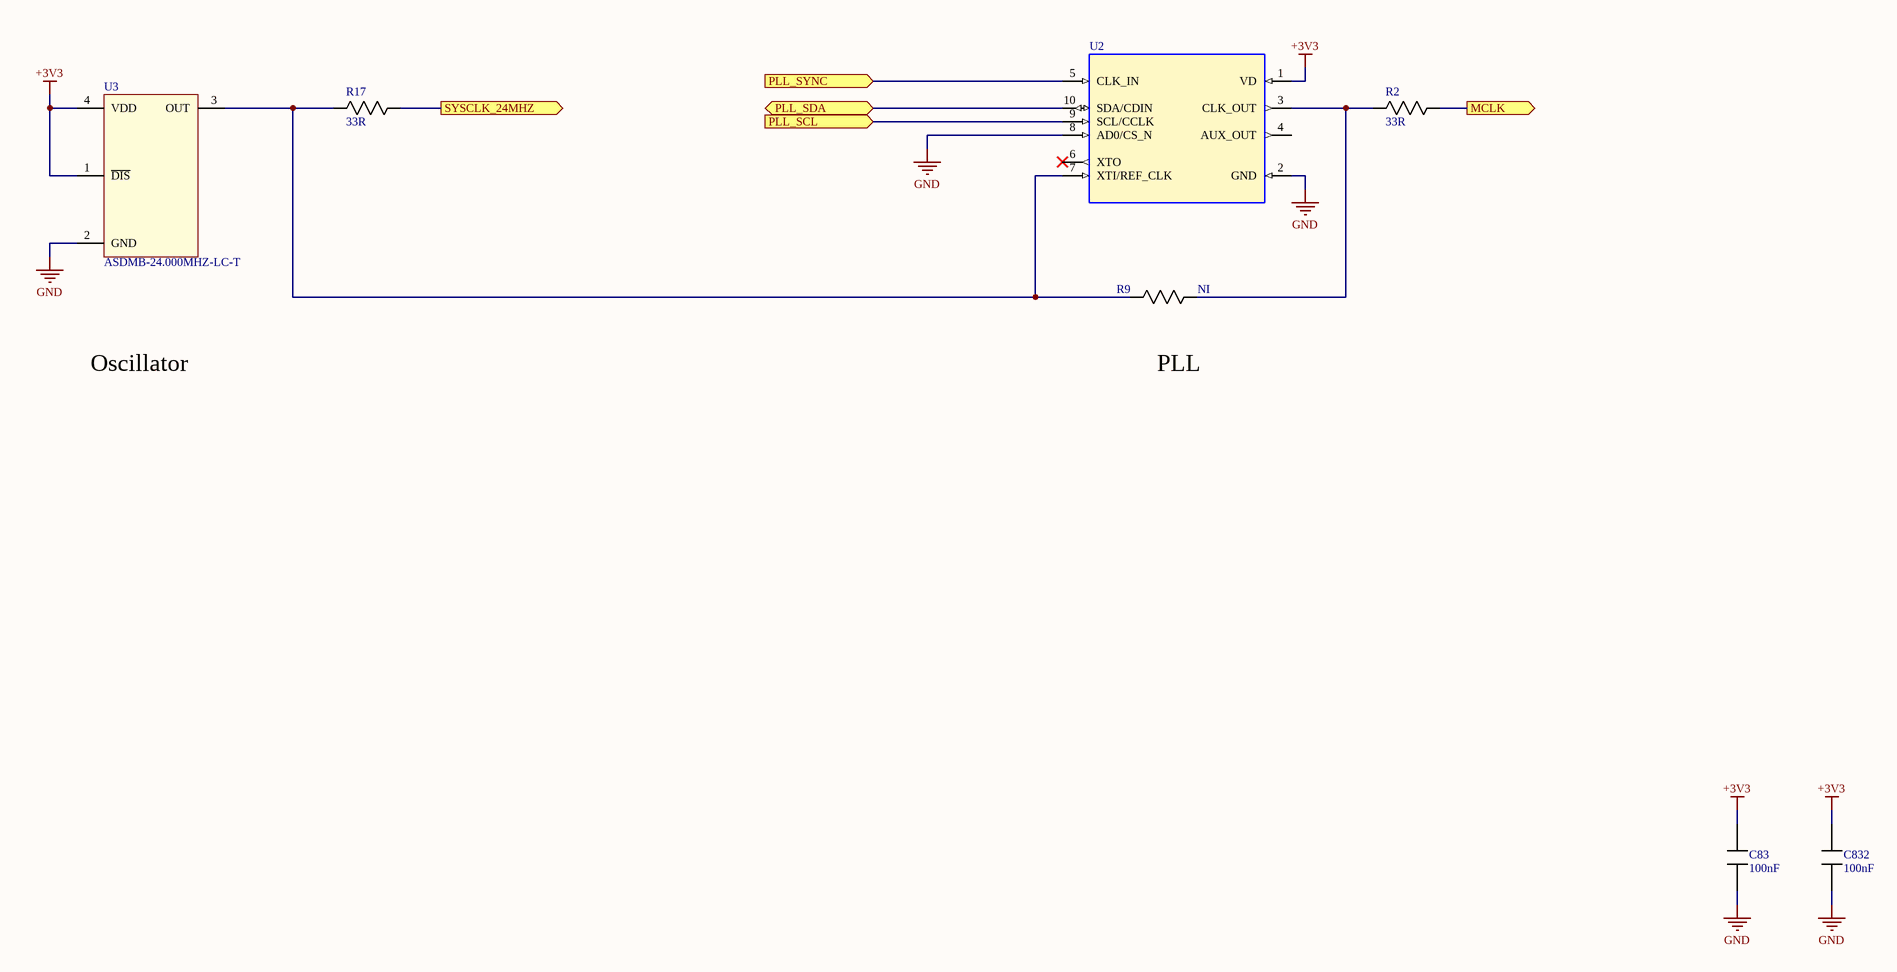
[diagram p3: Clock.SchDoc]

### Parts
C83  value 100nF  [0603]  (hidden comment: Capacitor)
C832  value 100nF  [0603]  (hidden comment: Capacitor)
R2  value 33R  [0603]  (hidden comment: Resistor)
R9  Resistor  [0603]  (value not drawn)
R17  value 33R  [0603]  (hidden comment: Resistor)
U2  CS2100_CP  [MSOP10]  (value not drawn)
U3  Mfg_PN: ASDMB-24.000MHZ-LC-T  [OSC_ADSMB]  (hidden comment: OSC_ASDMB)

### Ports
MCLK (out), PLL_SCL (in), PLL_SDA (bidir), PLL_SYNC (in), SYSCLK_24MHZ (out)

### Nets
+3V3: C83.1 C832.1 U2.1(VD) U3.1(~{DIS}) U3.4(VDD)
GND: C83.2 C832.2 U2.2(GND) U2.8(AD0/CS_N) U3.2(GND)
I2C_SCL: U2.9(SCL/CCLK) ; port PLL_SCL
I2C_SDA: U2.10(SDA/CDIN) ; port PLL_SDA
NetR2_1: R2.1 R9.2 U2.3(CLK_OUT)
NetR2_2: R2.2 ; port MCLK
NetR9_1: R9.1 R17.1 U2.7(XTI/REF_CLK) U3.3(OUT)
NetR17_2: R17.2 ; port SYSCLK_24MHZ
NetU2_5: U2.5(CLK_IN) ; port PLL_SYNC

Not connected (* = marked no-connect by the designer): U2 4(AUX_OUT) 6(XTO)*

### Notes on the sheet
- Oscillator
- PLL
- Sheet name
- http://creativecommons.org
- Project name
- Contact
- Rev
- Date
- Sheet
- of

### Library data of the parts
R9 = Resistor: Value: 0R; HelpURL: *; Mfg: *; Mfg_PN: *; NI: NI; Supplier1: *; Supplier1_PN: *; Type: *; Rating: *; Tolerance: *
U2 = CS2100_CP: Fractional-N Clock Multiplier, Crystal Reference, MSOP10; Mfg: Cirrus Logic; Mfg_PN: CS2100-CP-CZZ; Supplier1: Digikey; Supplier1_PN: 598-1750-ND
U3 = OSC_ASDMB: Oscillator; 1V8 to 3V3; Mfg: Abracon; HelpURL: http://www.abracon.com/Oscillators/ASDMB.pdf; Supplier1: Digikey; Supplier1_PN: 535-11728-1-ND; NI: *; Type: 24MHz
C83 C832 = Capacitor: HelpURL: *; Mfg: *; Mfg_PN: *; NI: *; Supplier1: *; Supplier1_PN: *; Tolerance: *; Type: *; Rating: *
R2 R17 = Resistor: HelpURL: *; Mfg: *; Mfg_PN: *; NI: *; Supplier1: *; Supplier1_PN: *; Type: *; Rating: *; Tolerance: *

## Sheet ADC.SchDoc
size Tabloid; DocumentNumber: 6; SheetNumber: 6; SheetTotal: 11; SheetName: ADC
Used 2 times, as channels ADC2, ADC1. Parts and nets are listed once, with the designators drawn on the sheet.
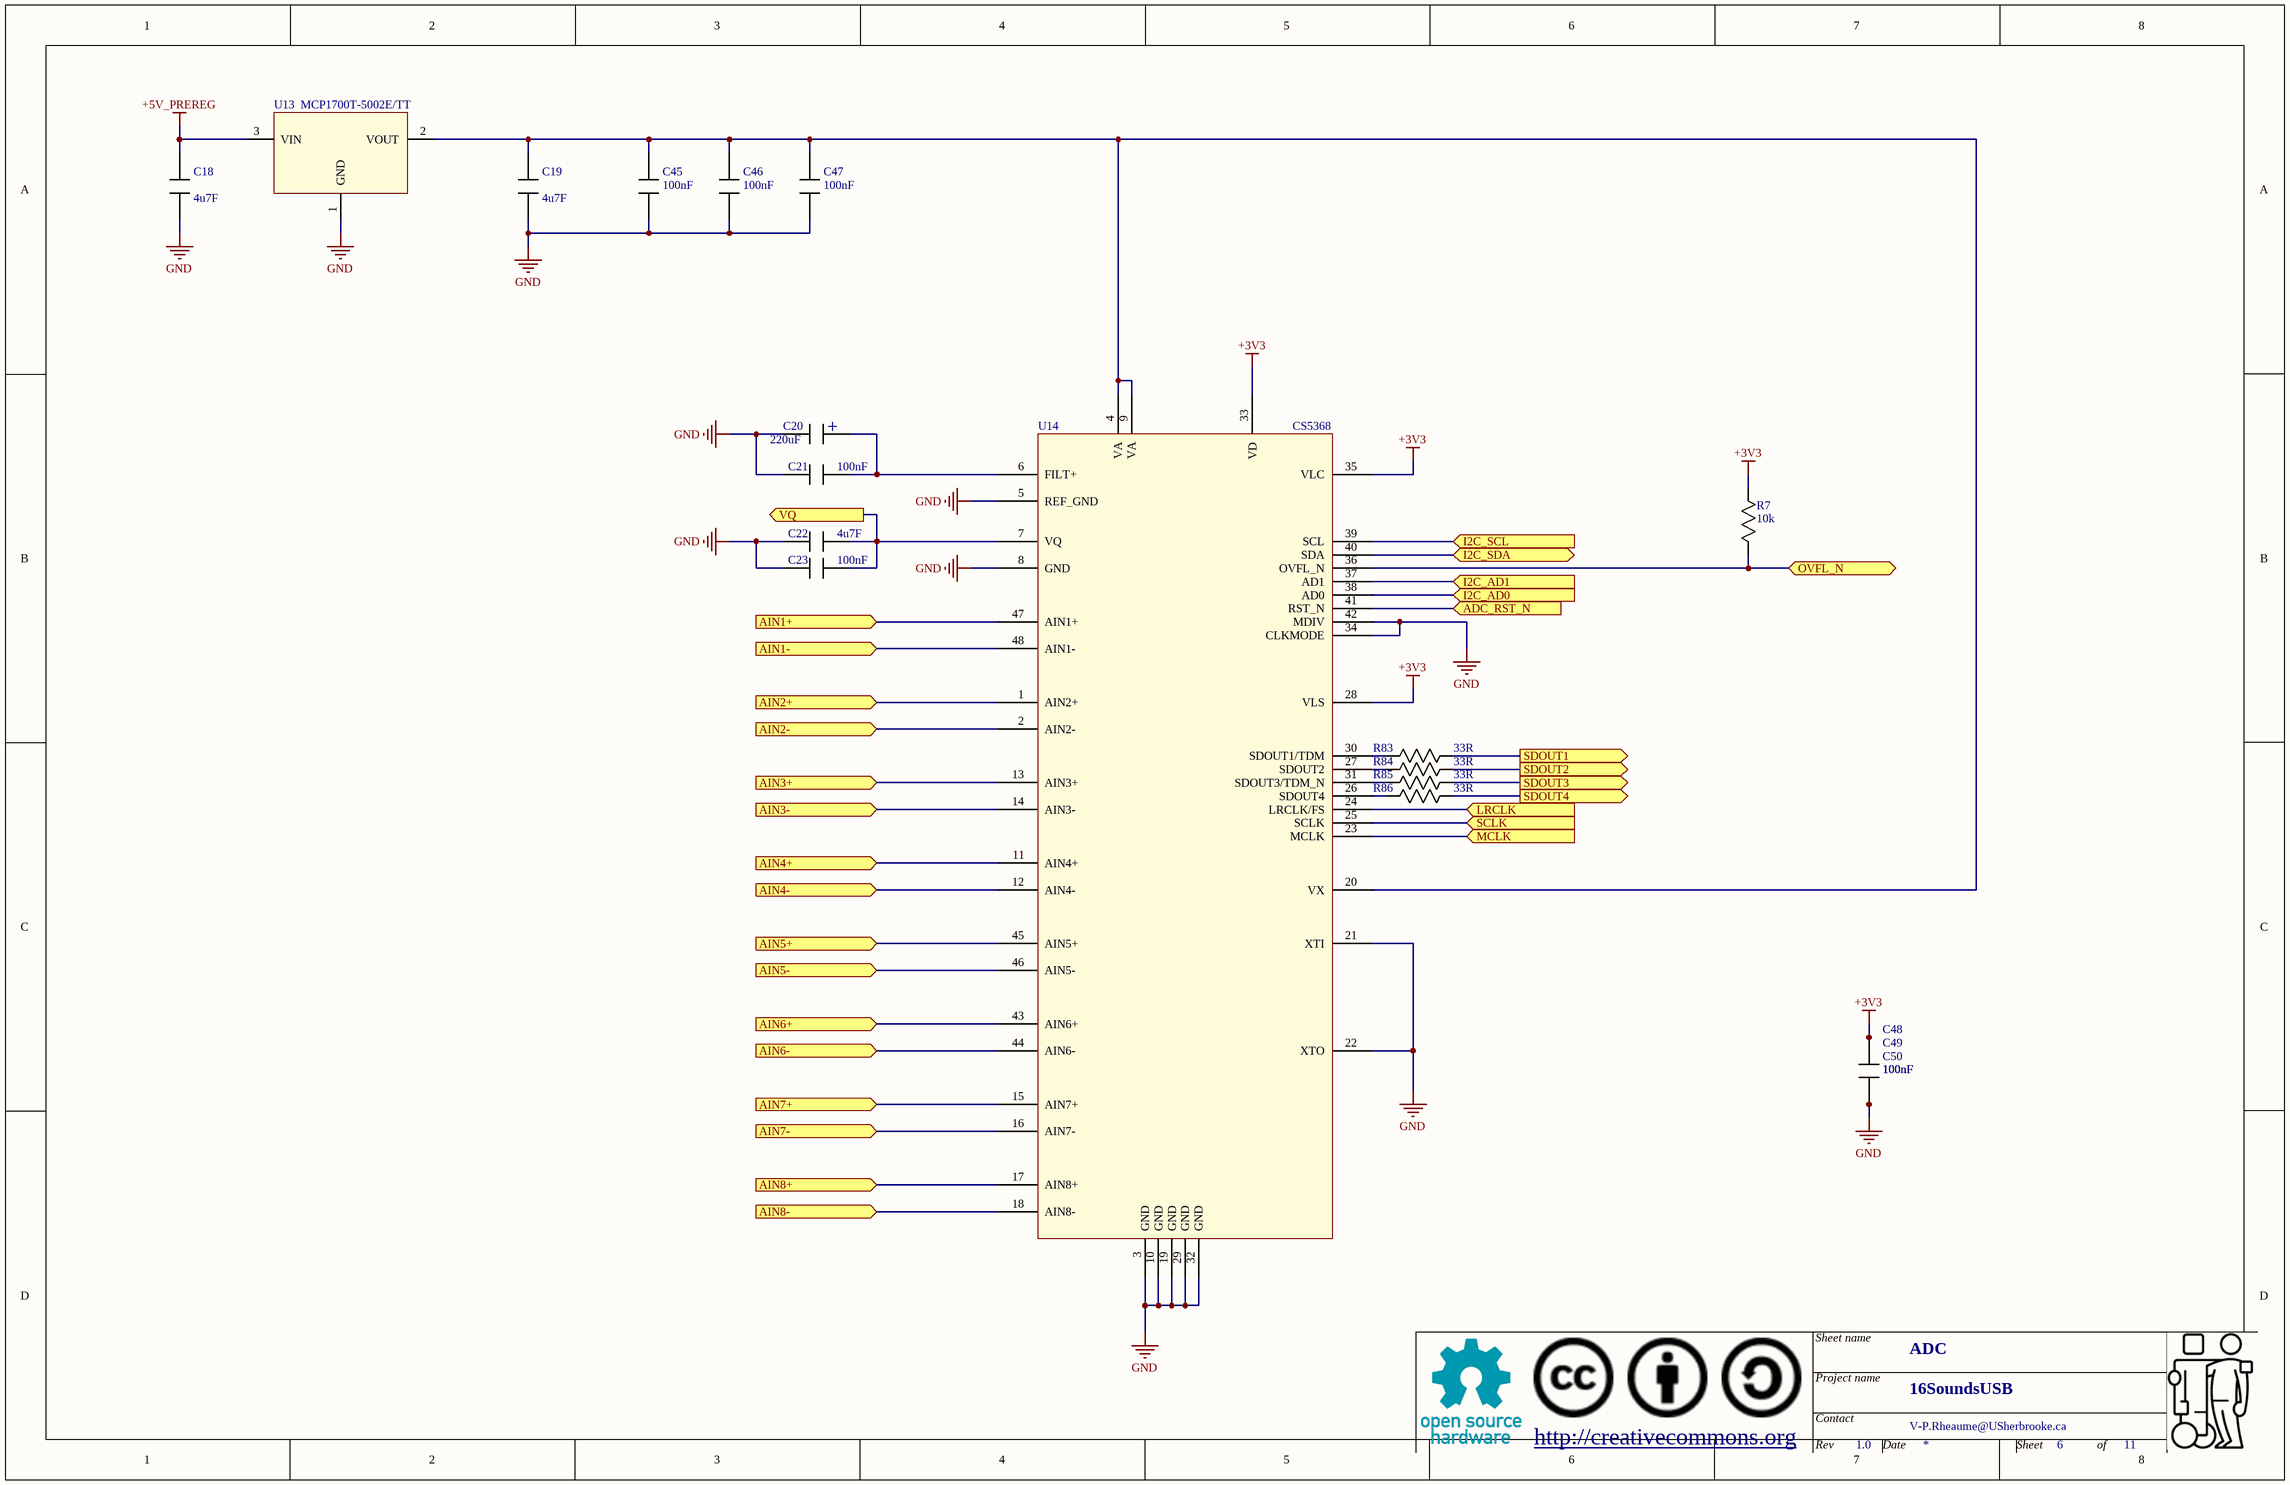
[diagram p4: ADC.SchDoc]

### Parts
C18  value 4u7F  [0805]  (hidden comment: Capacitor)
C19  value 4u7F  [0805]  (hidden comment: Capacitor)
C20  value 220uF  [CAP_RAD_SMD_DIA315]  (hidden comment: Capacitor_Polarized)
C21  value 100nF  [0603]  (hidden comment: Capacitor)
C22  value 4u7F  [0805]  (hidden comment: Capacitor)
C23  value 100nF  [0603]  (hidden comment: Capacitor)
C45  value 100nF  [0603]  (hidden comment: Capacitor)
C46  value 100nF  [0603]  (hidden comment: Capacitor)
C47  value 100nF  [0603]  (hidden comment: Capacitor)
C48  value 100nF  [0603]  (hidden comment: Capacitor)
C49  value 100nF  [0603]  (hidden comment: Capacitor)
C50  value 100nF  [0603]  (hidden comment: Capacitor)
R7  value 10k  [0603]  (hidden comment: Resistor)
R83  value 33R  [0603]  (hidden comment: Resistor)
R84  value 33R  [0603]  (hidden comment: Resistor)
R85  value 33R  [0603]  (hidden comment: Resistor)
R86  value 33R  [0603]  (hidden comment: Resistor)
U13  Mfg_PN: MCP1700T-5002E/TT  [SOT23_132]  (hidden comment: MCP1700)
U14  CS5368  [LQFP_48L_CIRRUS]

### Ports
ADC_RST_N (in), AIN1+ (in), AIN1- (in), AIN2+ (in), AIN2- (in), AIN3+ (in), AIN3- (in), AIN4+ (in), AIN4- (in), AIN5+ (in), AIN5- (in), AIN6+ (in), AIN6- (in), AIN7+ (in), AIN7- (in), AIN8+ (in), AIN8- (in), I2C_AD0 (in), I2C_AD1 (in), I2C_SCL (in), I2C_SDA (bidir), LRCLK (in), MCLK (in), OVFL_N (bidir), SCLK (in), SDOUT1 (out), SDOUT2 (out), SDOUT3 (out), SDOUT4 (out), VQ (out)

### Nets
+3V3: C48.1 C49.1 C50.1 R7.1 U14.28(VLS) U14.33(VD) U14.35(VLC)
+5V_PREREG: C18.1 U13.3(VIN)
GND: C18.2 C19.2 C20.- C21.2 C22.2 C23.2 C45.2 C46.2 C47.2 C48.2 C49.2 C50.2 U13.1(GND) U14.3(GND) U14.5(REF_GND) U14.8(GND) U14.10(GND) U14.19(GND) U14.21(XTI) U14.22(XTO) U14.29(GND) U14.32(GND) U14.34(CLKMODE) U14.42(MDIV)
ADC_RST_N: U14.41(RST_N) ; port ADC_RST_N
AIN1+: U14.47(AIN1+) ; port AIN1+
AIN1-: U14.48(AIN1-) ; port AIN1-
AIN2+: U14.1(AIN2+) ; port AIN2+
AIN2-: U14.2(AIN2-) ; port AIN2-
AIN3+: U14.13(AIN3+) ; port AIN3+
AIN3-: U14.14(AIN3-) ; port AIN3-
AIN4+: U14.11(AIN4+) ; port AIN4+
AIN4-: U14.12(AIN4-) ; port AIN4-
AIN5+: U14.45(AIN5+) ; port AIN5+
AIN5-: U14.46(AIN5-) ; port AIN5-
AIN6+: U14.43(AIN6+) ; port AIN6+
AIN6-: U14.44(AIN6-) ; port AIN6-
AIN7+: U14.15(AIN7+) ; port AIN7+
AIN7-: U14.16(AIN7-) ; port AIN7-
AIN8+: U14.17(AIN8+) ; port AIN8+
AIN8-: U14.18(AIN8-) ; port AIN8-
I2C_AD0: U14.38(AD0) ; port I2C_AD0
I2C_AD1: U14.37(AD1) ; port I2C_AD1
I2C_SCL: U14.39(SCL) ; port I2C_SCL
I2C_SDA: U14.40(SDA) ; port I2C_SDA
LRCLK: U14.24(LRCLK/FS) ; port LRCLK
MCLK: U14.23(MCLK) ; port MCLK
OVFL_N: R7.2 U14.36(OVFL_N) ; port OVFL_N
SCLK: U14.25(SCLK) ; port SCLK
SDOUT1: R83.2 ; port SDOUT1
SDOUT2: R84.2 ; port SDOUT2
SDOUT3: R85.2 ; port SDOUT3
SDOUT4: R86.2 ; port SDOUT4
VQ: C22.1 C23.1 U14.7(VQ) ; port VQ
NetC19_1: C19.1 C45.1 C46.1 C47.1 U13.2(VOUT) U14.4(VA) U14.9(VA) U14.20(VX)
NetC20_+: C20.+ C21.1 U14.6(FILT+)
NetR83_1: R83.1 U14.30(SDOUT1/TDM)
NetR84_1: R84.1 U14.27(SDOUT2)
NetR85_1: R85.1 U14.31(SDOUT3/TDM_N)
NetR86_1: R86.1 U14.26(SDOUT4)

### Channels
ADC2: designators end in _ADC2; ports ADC_RST_N=NetTP3_1 AIN1+=IN13_P AIN1-=IN13_N AIN2+=IN14_P AIN2-=IN14_N AIN3+=IN11_P AIN3-=IN11_N AIN4+=IN12_P AIN4-=IN12_N AIN5+=IN15_P AIN5-=IN15_N AIN6+=IN16_P AIN6-=IN16_N AIN7+=IN9_P AIN7-=IN9_N AIN8+=IN10_P AIN8-=IN10_N I2C_AD0=GND I2C_AD1=GND I2C_SCL=I2C_SCL I2C_SDA=I2C_SDA LRCLK=LRCLK MCLK=MCLK_AUDIO OVFL_N=NetR7_ADC1_2 SCLK=SCLK SDOUT1=ADC2_SDOUT1 SDOUT2=ADC2_SDOUT2 SDOUT3=ADC2_SDOUT3 SDOUT4=ADC2_SDOUT4 VQ=ADC2_VQ
ADC1: designators end in _ADC1; ports ADC_RST_N=NetTP3_1 AIN1+=IN5_P AIN1-=IN5_N AIN2+=IN6_P AIN2-=IN6_N AIN3+=IN3_P AIN3-=IN3_N AIN4+=IN4_P AIN4-=IN4_N AIN5+=IN7_P AIN5-=IN7_N AIN6+=IN8_P AIN6-=IN8_N AIN7+=IN1_P AIN7-=IN1_N AIN8+=IN2_P AIN8-=IN2_N I2C_AD0=+3V3 I2C_AD1=GND I2C_SCL=I2C_SCL I2C_SDA=I2C_SDA LRCLK=LRCLK MCLK=MCLK_AUDIO OVFL_N=NetR7_ADC1_2 SCLK=SCLK SDOUT1=ADC1_SDOUT1 SDOUT2=ADC1_SDOUT2 SDOUT3=ADC1_SDOUT3 SDOUT4=ADC1_SDOUT4 VQ=ADC1_VQ

### Notes on the sheet
- Sheet name
- http://creativecommons.org
- Project name
- Contact
- Rev
- Date
- Sheet
- of

### Library data of the parts
C20 = Capacitor_Polarized: Capacitor; HelpURL: *; Mfg: *; Mfg_PN: *; NI: *; Supplier1: *; Supplier1_PN: *; Tolerance: *; Type: *; Rating: *
U13 = MCP1700: Linear voltage regulator; Mfg: Microchip; HelpURL: http://ww1.microchip.com/downloads/en/DeviceDoc/20001826C.pdf; NI: *; Supplier1: Digikey; Supplier1_PN: MCP1700T5002ETTCT-ND; Type: *
U14 = CS5368: ADC, 24bit, 8 chan, 192kHz, PCM, TDM, LQFP48; Mfg_PN: CS5368-CQZ; Mfg: Cirrus; Supplier1: Digikey; Supplier1_PN: 598-1090-ND
C18 C19 C21-C23 C45-C50 = Capacitor: HelpURL: *; Mfg: *; Mfg_PN: *; NI: *; Supplier1: *; Supplier1_PN: *; Tolerance: *; Type: *; Rating: *
R7 R83-R86 = Resistor: HelpURL: *; Mfg: *; Mfg_PN: *; NI: *; Supplier1: *; Supplier1_PN: *; Type: *; Rating: *; Tolerance: *

## Sheet DAC.SchDoc
size Tabloid; DocumentNumber: 7; SheetNumber: 7; SheetTotal: 11; SheetName: DAC
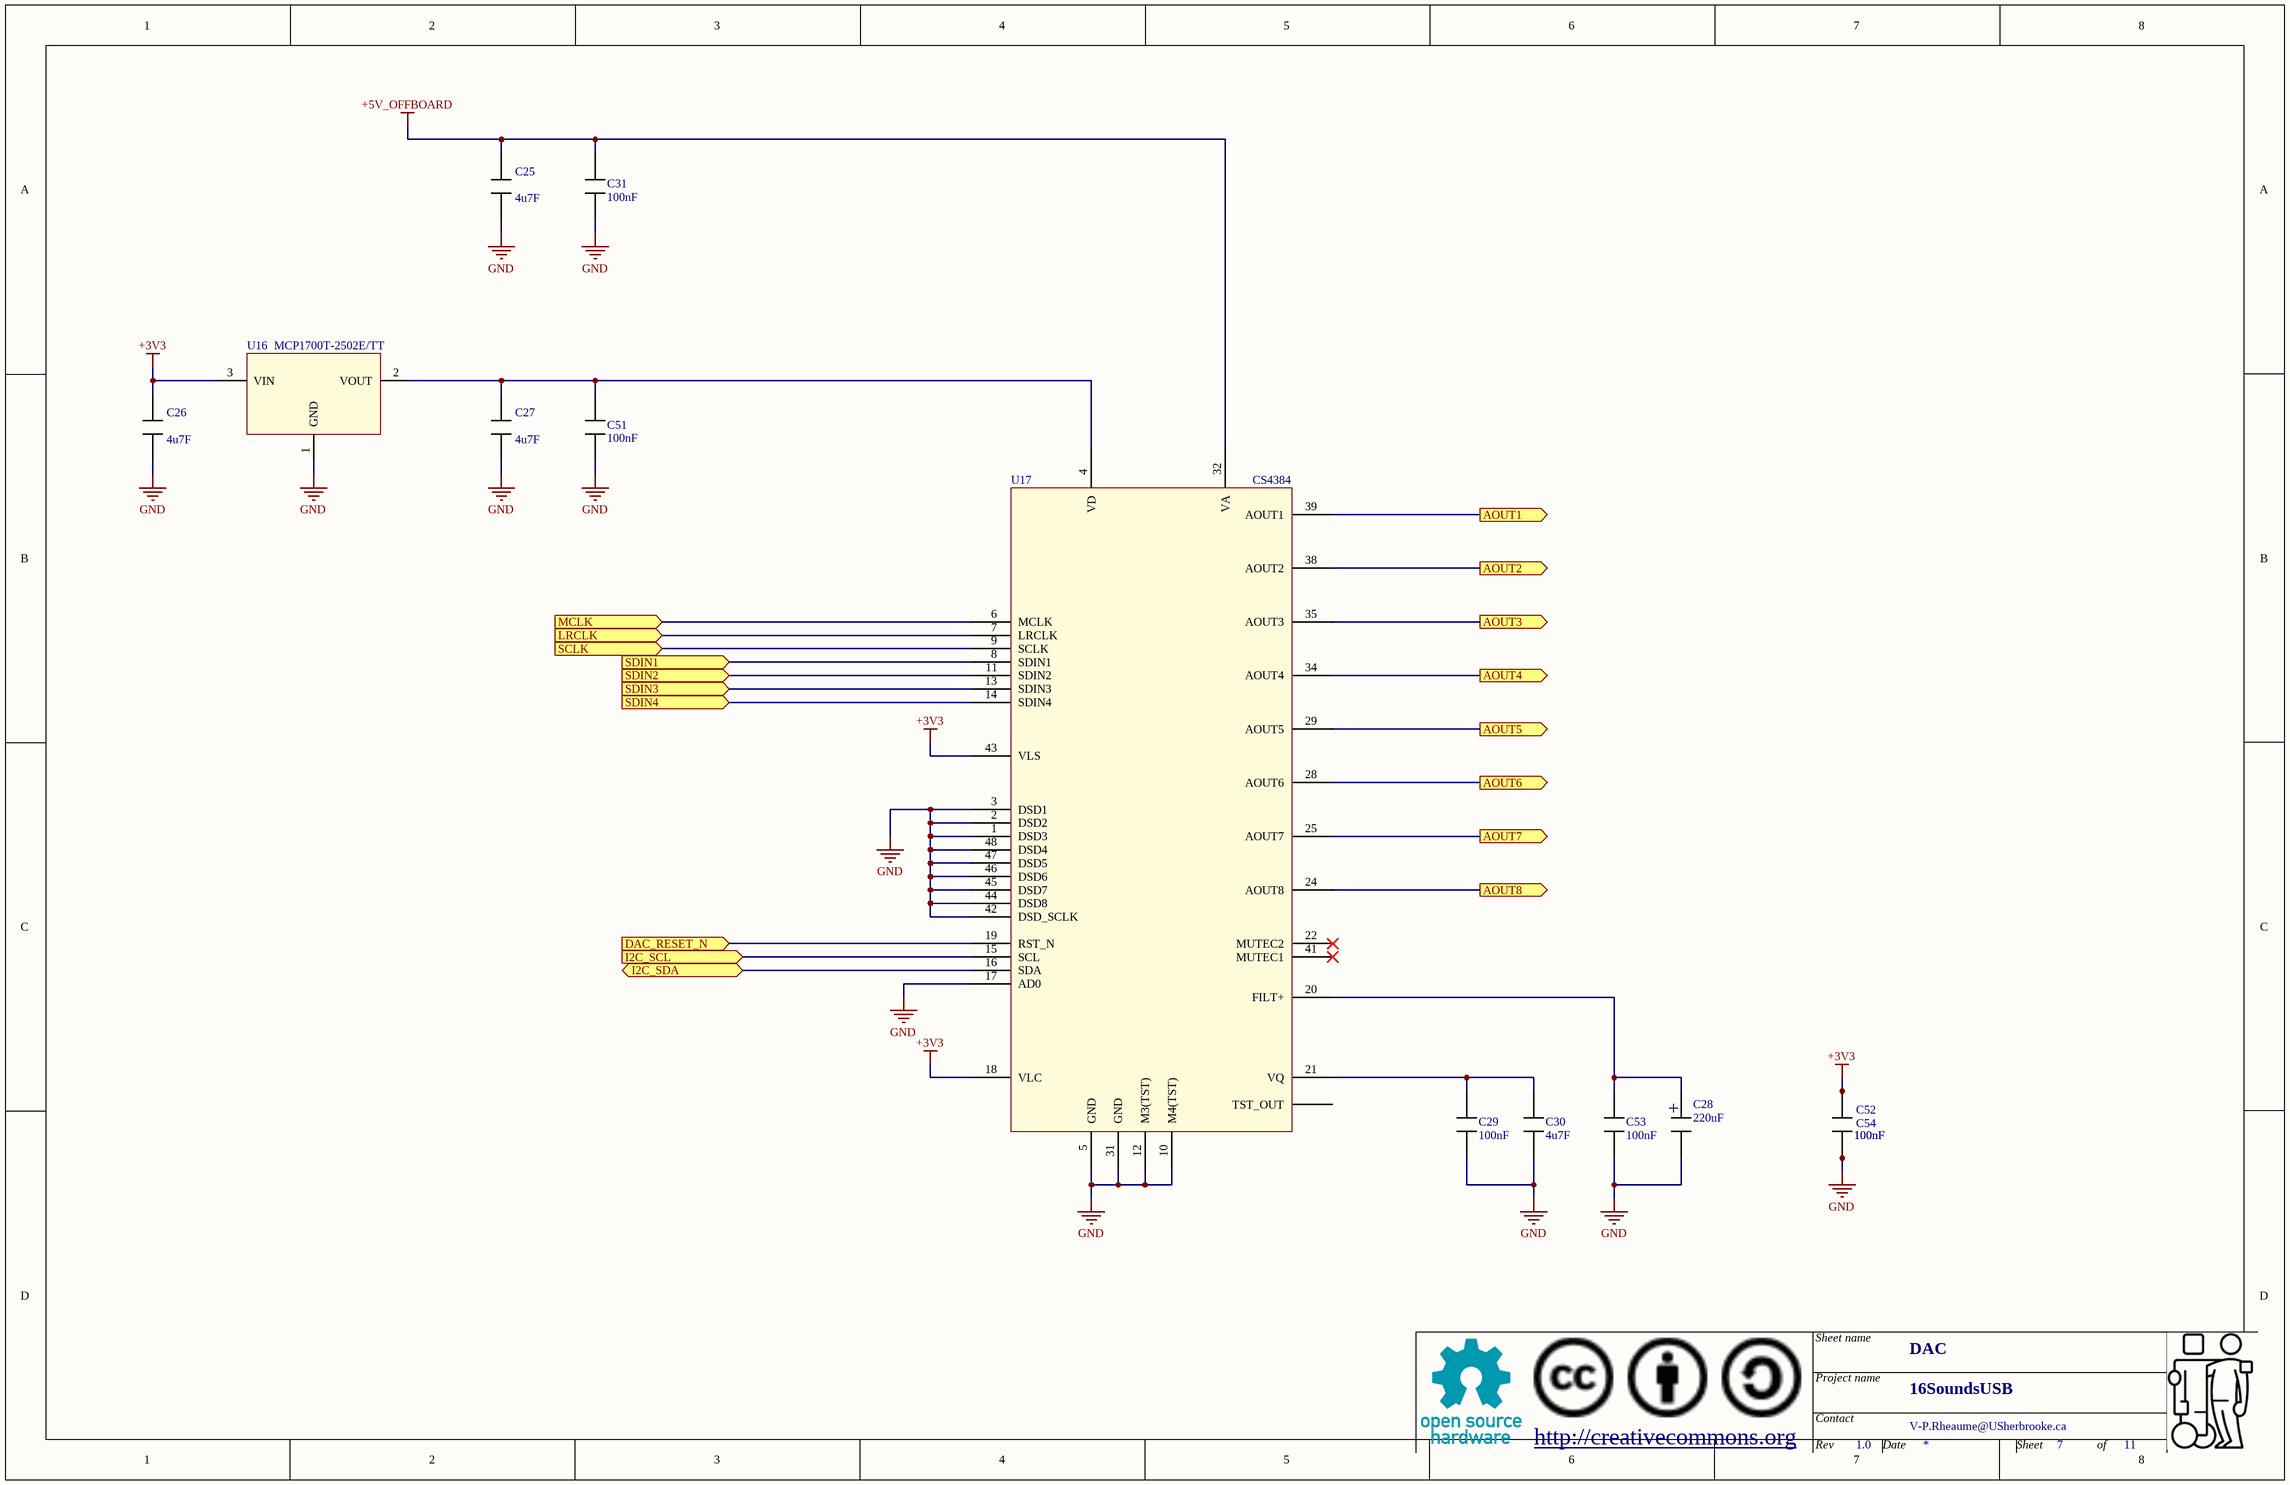
[diagram p5: DAC.SchDoc]

### Parts
C25  value 4u7F  [0805]  (hidden comment: Capacitor)
C26  value 4u7F  [0805]  (hidden comment: Capacitor)
C27  value 4u7F  [0805]  (hidden comment: Capacitor)
C28  value 220uF  [CAP_RAD_SMD_DIA315]  (hidden comment: Capacitor_Polarized)
C29  value 100nF  [0603]  (hidden comment: Capacitor)
C30  value 4u7F  [0805]  (hidden comment: Capacitor)
C31  value 100nF  [0603]  (hidden comment: Capacitor)
C51  value 100nF  [0603]  (hidden comment: Capacitor)
C52  value 100nF  [0603]  (hidden comment: Capacitor)
C53  value 100nF  [0603]  (hidden comment: Capacitor)
C54  value 100nF  [0603]  (hidden comment: Capacitor)
U16  Mfg_PN: MCP1700T-2502E/TT  [SOT23_132]  (hidden comment: MCP1700)
U17  CS4384  [LQFP_48L_CIRRUS]

### Ports
AOUT1 (out), AOUT2 (out), AOUT3 (out), AOUT4 (out), AOUT5 (out), AOUT6 (out), AOUT7 (out), AOUT8 (out), DAC_RESET_N (in), I2C_SCL (in), I2C_SDA (bidir), LRCLK (in), MCLK (in), SCLK (in), SDIN1 (in), SDIN2 (in), SDIN3 (in), SDIN4 (in)

### Nets
+3V3: C26.1 C52.1 C54.1 U16.3(VIN) U17.18(VLC) U17.43(VLS)
+5V_OFFBOARD: C25.1 C31.1 U17.32(VA)
GND: C25.2 C26.2 C27.2 C28.- C29.2 C30.2 C31.2 C51.2 C52.2 C53.2 C54.2 U16.1(GND) U17.1(DSD3) U17.2(DSD2) U17.3(DSD1) U17.5(GND) U17.10(M4(TST)) U17.12(M3(TST)) U17.17(AD0) U17.31(GND) U17.42(DSD_SCLK) U17.44(DSD8) U17.45(DSD7) U17.46(DSD6) U17.47(DSD5) U17.48(DSD4)
DAC_SDIN1: U17.8(SDIN1) ; port SDIN1
DAC_SDIN2: U17.11(SDIN2) ; port SDIN2
I2C_SCL: U17.15(SCL) ; port I2C_SCL
I2C_SDA: U17.16(SDA) ; port I2C_SDA
LRCLK: U17.7(LRCLK) ; port LRCLK
MCLK_AUDIO: U17.6(MCLK) ; port MCLK
SCLK: U17.9(SCLK) ; port SCLK
NetC27_1: C27.1 C51.1 U16.2(VOUT) U17.4(VD)
NetC28_+: C28.+ C53.1 U17.20(FILT+)
NetC29_1: C29.1 C30.1 U17.21(VQ)
NetC36_+: U17.39(AOUT1) ; port AOUT1
NetC37_+: U17.35(AOUT3) ; port AOUT3
NetC40_+: U17.38(AOUT2) ; port AOUT2
NetC41_+: U17.34(AOUT4) ; port AOUT4
NetU17_13: U17.13(SDIN3) ; port SDIN3
NetU17_14: U17.14(SDIN4) ; port SDIN4
NetU17_19: U17.19(RST_N) ; port DAC_RESET_N
NetU17_24: U17.24(AOUT8) ; port AOUT8
NetU17_25: U17.25(AOUT7) ; port AOUT7
NetU17_28: U17.28(AOUT6) ; port AOUT6
NetU17_29: U17.29(AOUT5) ; port AOUT5

Not connected (* = marked no-connect by the designer): U17 22(MUTEC2)* 23(TST_OUT) 26(TST_OUT) 27(TST_OUT) 30(TST_OUT) 33(TST_OUT) 36(TST_OUT) 37(TST_OUT) 40(TST_OUT) 41(MUTEC1)*

### Notes on the sheet
- Sheet name
- http://creativecommons.org
- Project name
- Contact
- Rev
- Date
- Sheet
- of

### Library data of the parts
C28 = Capacitor_Polarized: Capacitor; HelpURL: *; Mfg: *; Mfg_PN: *; NI: *; Supplier1: *; Supplier1_PN: *; Tolerance: *; Type: *; Rating: *
U16 = MCP1700: Linear voltage regulator; Mfg: Microchip; HelpURL: http://ww1.microchip.com/downloads/en/DeviceDoc/20001826C.pdf; NI: *; Supplier1: Digikey; Supplier1_PN: MCP1700T-2502E/TTCT-ND; Type: *
U17 = CS4384: DAC, 24-bit, 8 chan, 192kHz, PCM, TDM, DSD, LQFP48; Mfg: Cirrus; Mfg_PN: CS4384-CQZ; Supplier1: Digikey; Supplier1_PN: 598-1062-ND
C25-C27 C29-C31 C51-C54 = Capacitor: HelpURL: *; Mfg: *; Mfg_PN: *; NI: *; Supplier1: *; Supplier1_PN: *; Tolerance: *; Type: *; Rating: *

## Sheet OutputConnectors.SchDoc
size Tabloid; DocumentNumber: 8; SheetNumber: 8; SheetTotal: 11; SheetName: Audio output connectors
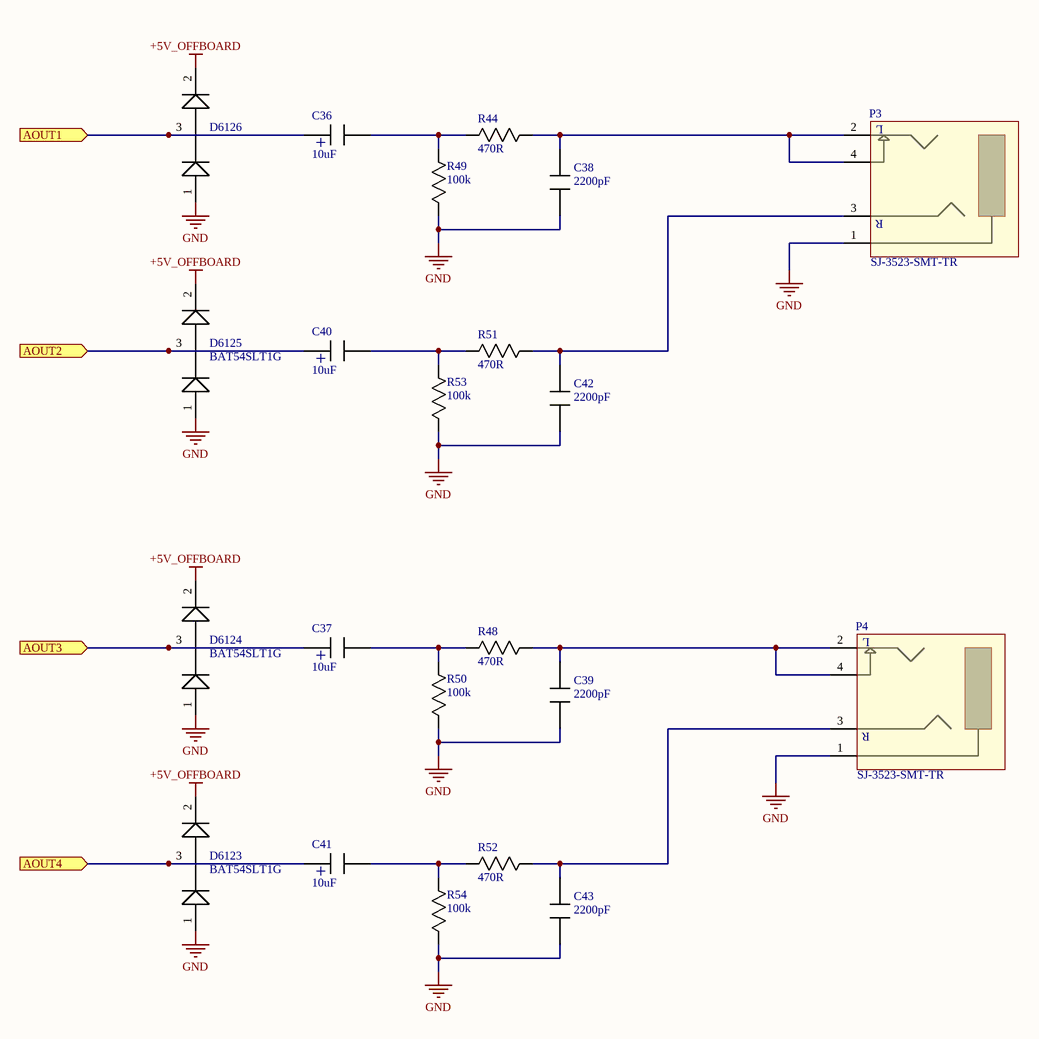
[diagram p6: OutputConnectors.SchDoc]

### Parts
C36  value 10uF  [CAP_RAD_SMD_DIA157]  (hidden comment: Capacitor_Polarized)
C37  value 10uF  [CAP_RAD_SMD_DIA157]  (hidden comment: Capacitor_Polarized)
C38  value 2200pF  [0603]  (hidden comment: Capacitor)
C39  value 2200pF  [0603]  (hidden comment: Capacitor)
C40  value 10uF  [CAP_RAD_SMD_DIA157]  (hidden comment: Capacitor_Polarized)
C41  value 10uF  [CAP_RAD_SMD_DIA157]  (hidden comment: Capacitor_Polarized)
C42  value 2200pF  [0603]  (hidden comment: Capacitor)
C43  value 2200pF  [0603]  (hidden comment: Capacitor)
D6123  Mfg_PN: BAT54SLT1G  [SOT23_132]  (hidden comment: Diode_dual)
D6124  Mfg_PN: BAT54SLT1G  [SOT23_132]  (hidden comment: Diode_dual)
D6125  Mfg_PN: BAT54SLT1G  [SOT23_132]  (hidden comment: Diode_dual)
D6126  Diode_dual  [SOT23_132]  (value not drawn)
P3  Mfg_PN: SJ-3523-SMT-TR  [CONN_3.5mm_CUI 3523-SMT]  (hidden comment: CON_AUDIO_3.5mm_TRS_ALT1)
P4  Mfg_PN: SJ-3523-SMT-TR  [CONN_3.5mm_CUI 3523-SMT]  (hidden comment: CON_AUDIO_3.5mm_TRS_ALT1)
R44  value 470R  [0603]  (hidden comment: Resistor)
R48  value 470R  [0603]  (hidden comment: Resistor)
R49  value 100k  [0603]  (hidden comment: Resistor)
R50  value 100k  [0603]  (hidden comment: Resistor)
R51  value 470R  [0603]  (hidden comment: Resistor)
R52  value 470R  [0603]  (hidden comment: Resistor)
R53  value 100k  [0603]  (hidden comment: Resistor)
R54  value 100k  [0603]  (hidden comment: Resistor)

### Ports
AOUT1 (in), AOUT2 (in), AOUT3 (in), AOUT4 (in)

### Nets
+5V_OFFBOARD: D6123.2(K) D6124.2(K) D6125.2(K) D6126.2(K)
GND: C38.2 C39.2 C42.2 C43.2 D6123.1(K) D6124.1(K) D6125.1(K) D6126.1(K) P3.1 P4.1 R49.1 R50.1 R53.1 R54.1
NetC36_+: C36.+ D6126.3(AK) ; port AOUT1
NetC36_-: C36.- R44.1 R49.2
NetC37_+: C37.+ D6124.3(AK) ; port AOUT3
NetC37_-: C37.- R48.1 R50.2
NetC38_1: C38.1 P3.2(L) P3.4(NC_L) R44.2
NetC39_1: C39.1 P4.2(L) P4.4(NC_L) R48.2
NetC40_+: C40.+ D6125.3(AK) ; port AOUT2
NetC40_-: C40.- R51.1 R53.2
NetC41_+: C41.+ D6123.3(AK) ; port AOUT4
NetC41_-: C41.- R52.1 R54.2
NetC42_1: C42.1 P3.3(R) R51.2
NetC43_1: C43.1 P4.3(R) R52.2

### Notes on the sheet
- Sheet name
- http://creativecommons.org
- Project name
- Contact
- Rev
- Date
- Sheet
- of

### Library data of the parts
C36 C37 C40 C41 = Capacitor_Polarized: Capacitor; HelpURL: *; Mfg: *; Mfg_PN: *; NI: *; Supplier1: *; Supplier1_PN: *; Tolerance: *; Type: *; Rating: *
D6123-D6125 = Diode_dual: Diode; Mfg: Onsemi; HelpURL: *; NI: *; Supplier1: Digikey; Supplier1_PN: BAT54SLT1GOSCT-ND; Tolerance: *; Type: *; Rating: *; Value: *
D6126 = Diode_dual: Diode; Mfg: Onsemi; Mfg_PN: BAT54SLT1G; HelpURL: *; NI: *; Supplier1: Digikey; Supplier1_PN: BAT54SLT1GOSCT-ND; Tolerance: *; Type: *; Rating: *; Value: *
P3 P4 = CON_AUDIO_3.5mm_TRS_ALT1: Audio 3.5mm CUI SJ-3523-SMT-TR; HelpURL: *; Mfg: CUI; NI: *; Rating: *; Supplier1: Digikey; Supplier1_PN: CP-3523SJCT-ND; Tolerance: *; Type: *; Value: *
C38 C39 C42 C43 = Capacitor: HelpURL: *; Mfg: *; Mfg_PN: *; NI: *; Supplier1: *; Supplier1_PN: *; Tolerance: *; Type: *; Rating: *
R44 R48-R54 = Resistor: HelpURL: *; Mfg: *; Mfg_PN: *; NI: *; Supplier1: *; Supplier1_PN: *; Type: *; Rating: *; Tolerance: *

## Sheet Other.SchDoc
size Tabloid; DocumentNumber: 9; SheetNumber: 9; SheetTotal: 11; SheetName: LEDs and I2C exp. connector
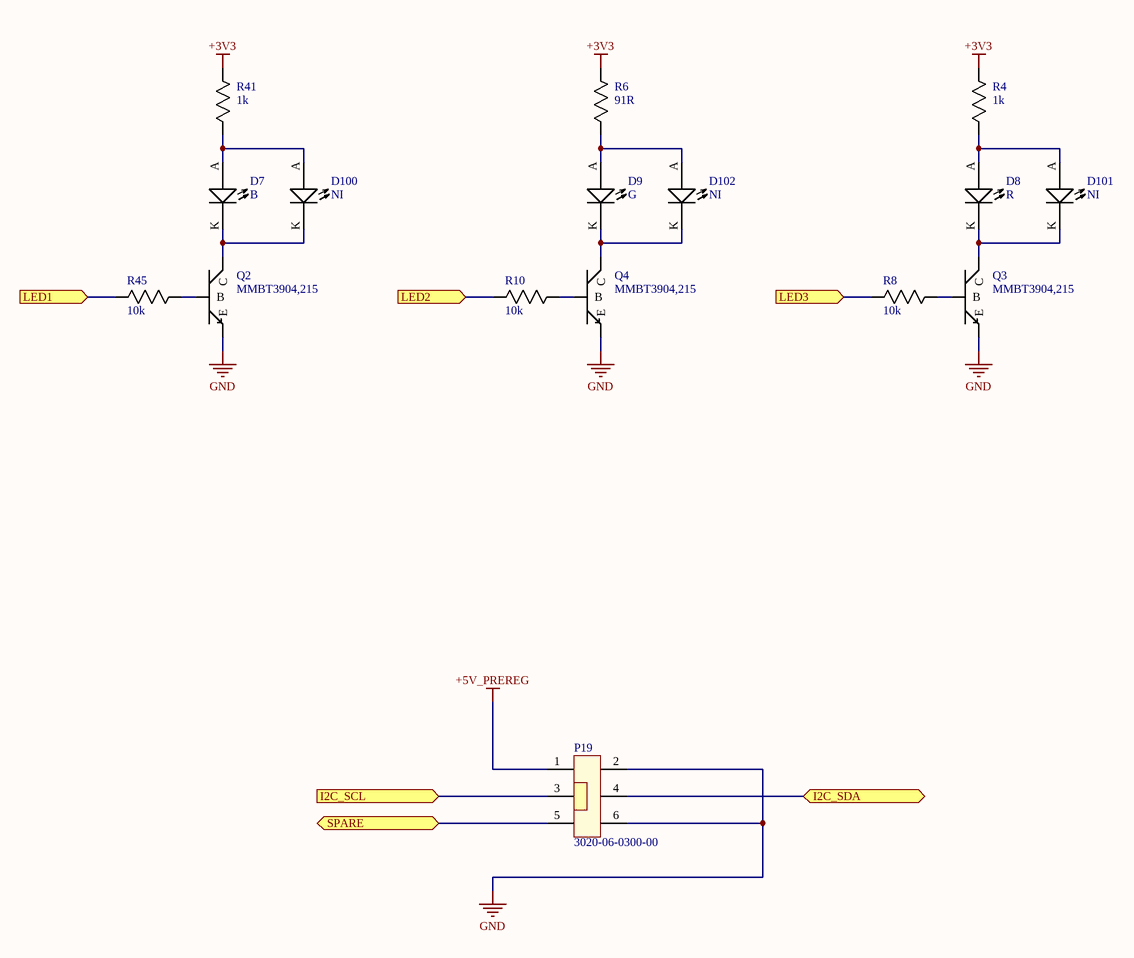
[diagram p7: Other.SchDoc]

### Parts
D7  Type: B  [0805_LED]  (hidden comment: Diode_LED)
D8  Type: R  [0805_LED]  (hidden comment: Diode_LED)
D9  Type: G  [0805_LED]  (hidden comment: Diode_LED)
D100  Diode_LED  [0805_LED]  (value not drawn)
D101  Diode_LED  [0805_LED]  (value not drawn)
D102  Diode_LED  [0805_LED]  (value not drawn)
P19  Mfg_PN: 3020-06-0300-00  [CONN6_100mils_pol_SMD]  (hidden comment: CON6_3020-06-0300-00)
Q2  Mfg_PN: MMBT3904,215  [SOT23_GDS]  (hidden comment: BJT_N_GDS)
Q3  Mfg_PN: MMBT3904,215  [SOT23_GDS]  (hidden comment: BJT_N_GDS)
Q4  Mfg_PN: MMBT3904,215  [SOT23_GDS]  (hidden comment: BJT_N_GDS)
R4  value 1k  [0603]  (hidden comment: Resistor)
R6  value 91R  [0603]  (hidden comment: Resistor)
R8  value 10k  [0603]  (hidden comment: Resistor)
R10  value 10k  [0603]  (hidden comment: Resistor)
R41  value 1k  [0603]  (hidden comment: Resistor)
R45  value 10k  [0603]  (hidden comment: Resistor)

### Ports
I2C_SCL (in), I2C_SDA (bidir), LED1 (in), LED2 (in), LED3 (in), SPARE (bidir)

### Nets
+3V3: R4.2 R6.2 R41.2
+5V_PREREG: P19.1
GND: P19.2 P19.6 Q2.S(E) Q3.S(E) Q4.S(E)
I2C_SCL: P19.3 ; port I2C_SCL
I2C_SDA: P19.4 ; port I2C_SDA
NetD7_A: D7.A D100.A R41.1
NetD7_K: D7.K D100.K Q2.D(C)
NetD8_A: D8.A D101.A R4.1
NetD8_K: D8.K D101.K Q3.D(C)
NetD9_A: D9.A D102.A R6.1
NetD9_K: D9.K D102.K Q4.D(C)
NetP19_5: P19.5 ; port SPARE
NetQ2_G: Q2.G(B) R45.2
NetQ3_G: Q3.G(B) R8.2
NetQ4_G: Q4.G(B) R10.2
NetR8_1: R8.1 ; port LED3
NetR10_1: R10.1 ; port LED2
NetR45_1: R45.1 ; port LED1

### Notes on the sheet
- Sheet name
- http://creativecommons.org
- Project name
- Contact
- Rev
- Date
- Sheet
- of

### Library data of the parts
D7 = Diode_LED: LED; Mfg: Wurth; Mfg_PN: 150080BS75000; HelpURL: *; NI: *; Supplier1: Digikey; Supplier1_PN: 732-4982-1-ND; Tolerance: *; Rating: *; Value: *
D8 = Diode_LED: LED; Mfg: Osram; Mfg_PN: LS R976-NR-1; HelpURL: *; NI: *; Supplier1: Digikey; Supplier1_PN: 475-1278-1-ND; Tolerance: *; Rating: *; Value: *
D9 = Diode_LED: LED; Mfg: Osram; Mfg_PN: LG R971-KN-1; HelpURL: *; NI: *; Supplier1: Digikey; Supplier1_PN: 475-1410-1-ND; Tolerance: *; Rating: *; Value: *
D100-D102 = Diode_LED: LED; Type: R; HelpURL: *; Mfg: *; Mfg_PN: *; NI: NI; Supplier1: *; Supplier1_PN: *; Tolerance: *; Rating: *; Value: *
P19 = CON6_3020-06-0300-00: 6-pins; Mfg: Harwin; HelpURL: *; NI: *; Rating: *; Supplier1: Digikey; Supplier1_PN: 3020-06-0300-00-ND; Tolerance: *; Type: *; Value: *
Q2-Q4 = BJT_N_GDS: BJT NPN; Mfg: NXP; HelpURL: *; NI: *; Rating: *; Supplier1: Digikey; Supplier1_PN: 568-4510-1-ND; Tolerance: *; Type: *; Value: *
R4 R6 R8 R10 R41 R45 = Resistor: HelpURL: *; Mfg: *; Mfg_PN: *; NI: *; Supplier1: *; Supplier1_PN: *; Type: *; Rating: *; Tolerance: *

## Sheet XMOS_power.SchDoc
size Tabloid; DocumentNumber: 3; SheetNumber: 3; SheetTotal: 11; SheetName: XMOS power supply
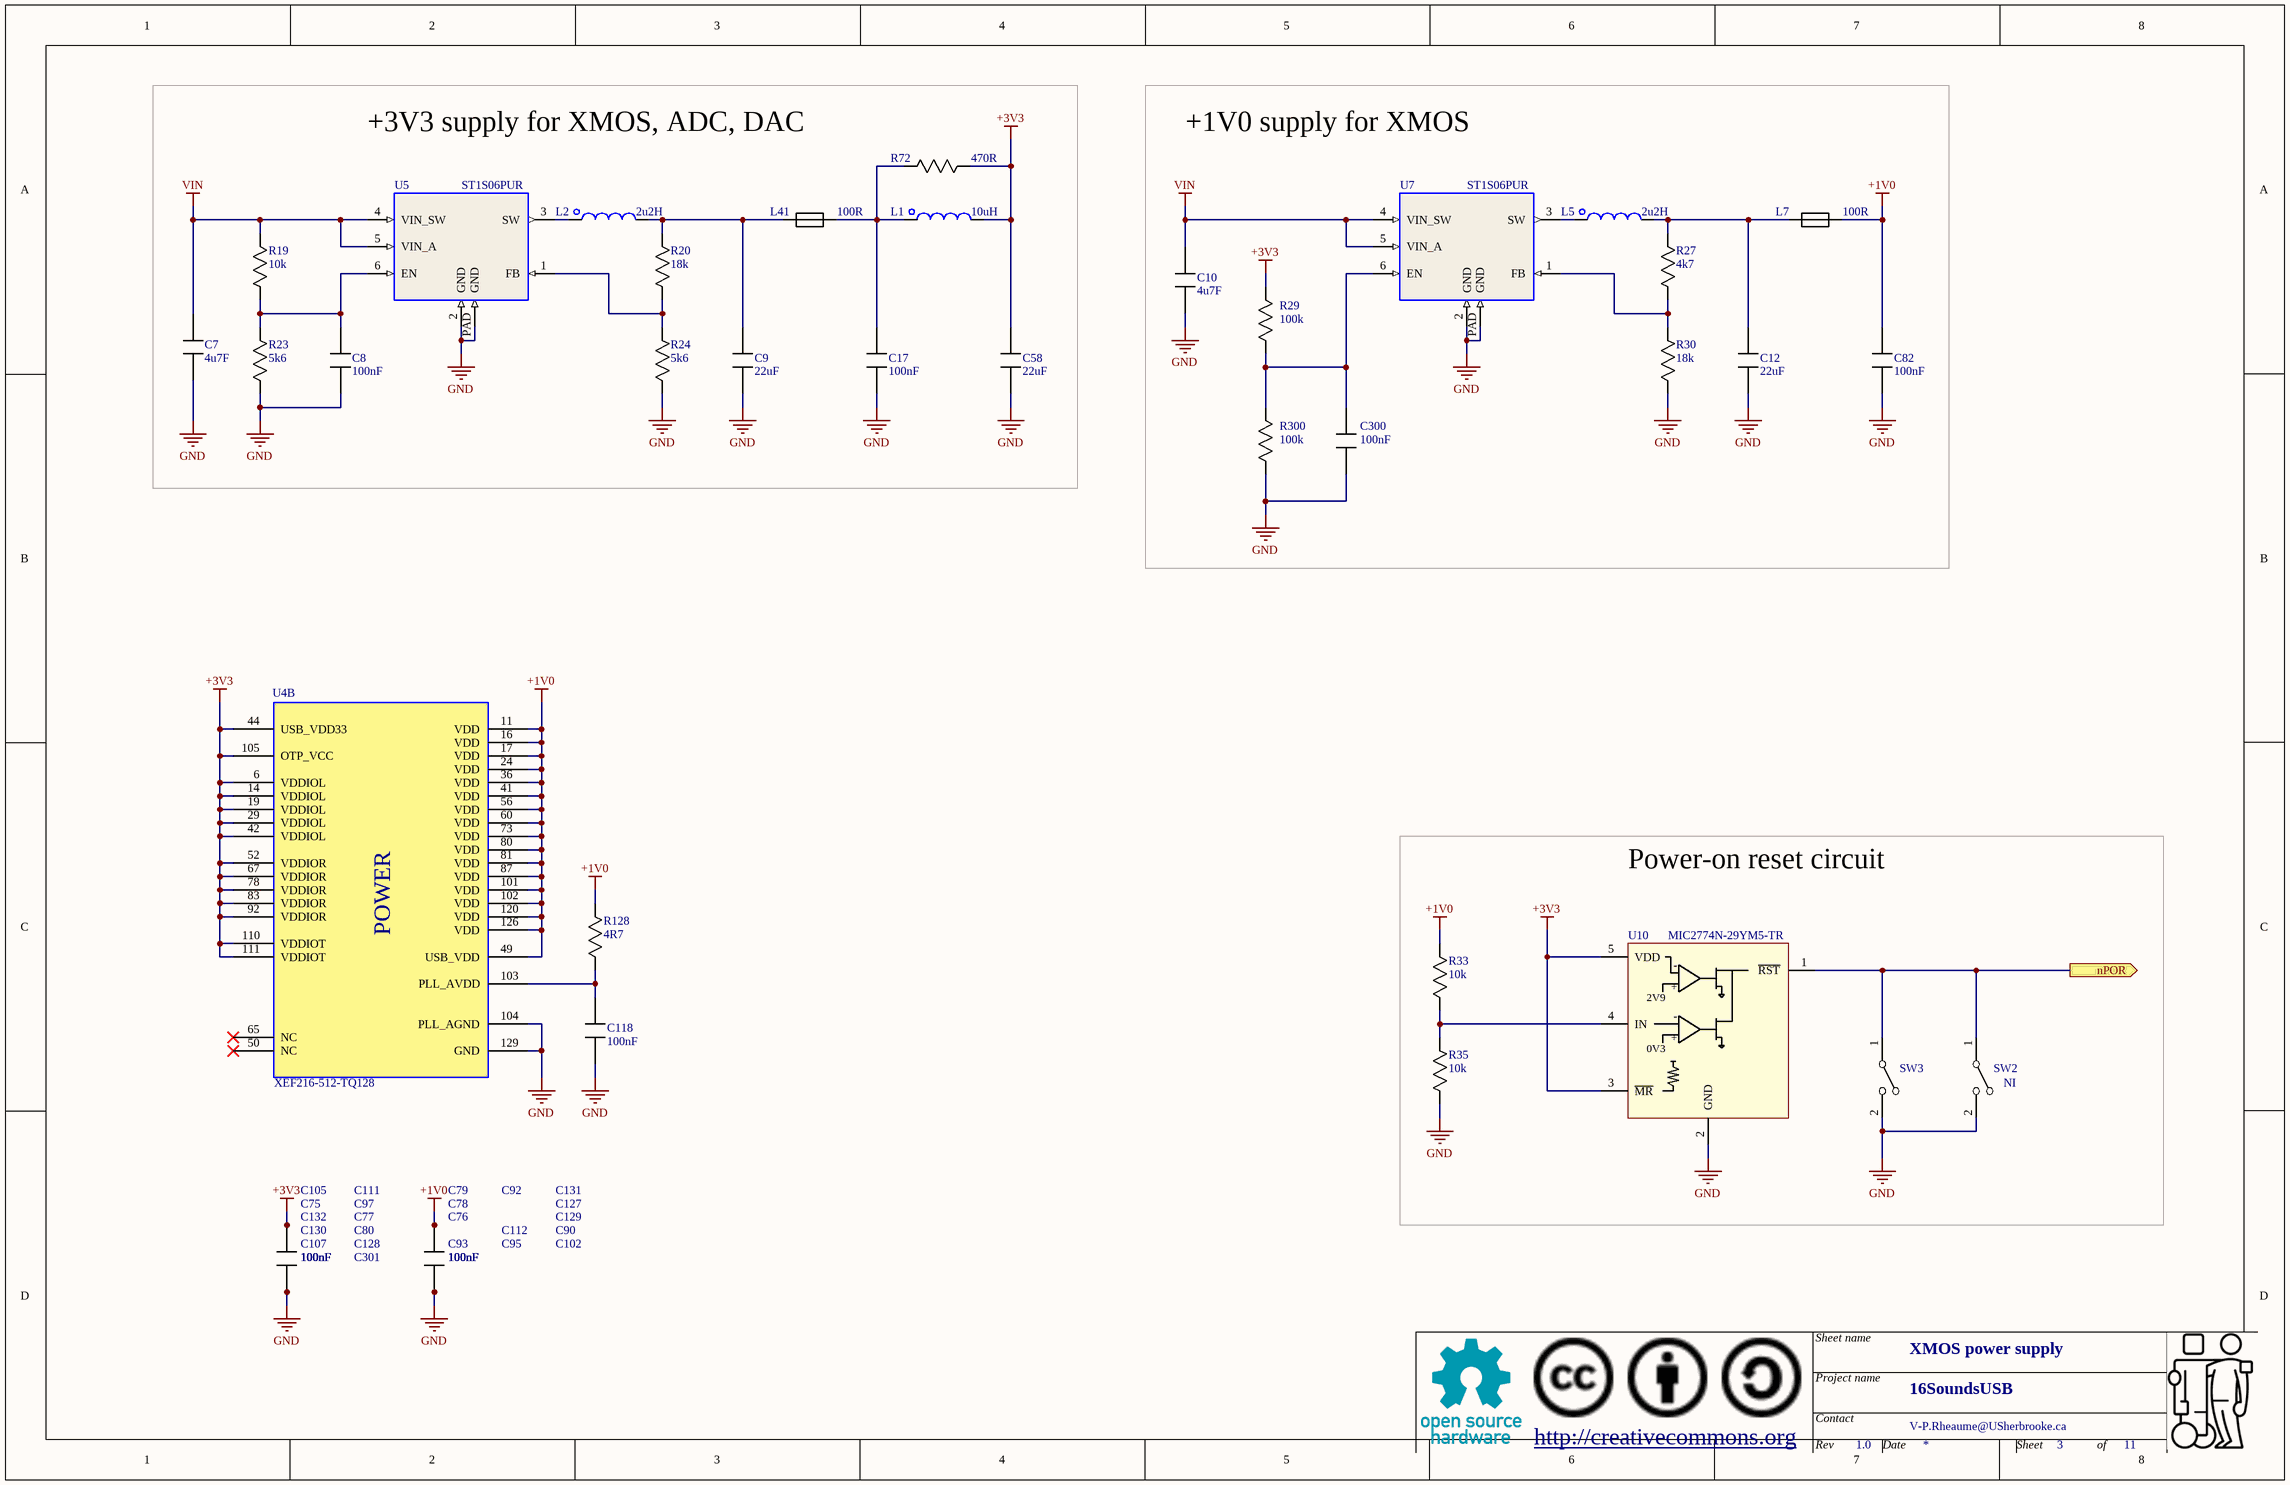
[diagram p8: XMOS_power.SchDoc]

### Parts
C7  value 4u7F  [0805]  (hidden comment: Capacitor)
C8  value 100nF  [0603]  (hidden comment: Capacitor)
C9  value 22uF  [1206]  (hidden comment: Capacitor)
C10  value 4u7F  [0805]  (hidden comment: Capacitor)
C12  value 22uF  [1206]  (hidden comment: Capacitor)
C17  value 100nF  [0603]  (hidden comment: Capacitor)
C58  value 22uF  [1206]  (hidden comment: Capacitor)
C75  value 100nF  [0603]  (hidden comment: Capacitor)
C76  value 100nF  [0603]  (hidden comment: Capacitor)
C77  value 100nF  [0603]  (hidden comment: Capacitor)
C78  value 100nF  [0603]  (hidden comment: Capacitor)
C79  value 100nF  [0603]  (hidden comment: Capacitor)
C80  value 100nF  [0603]  (hidden comment: Capacitor)
C82  value 100nF  [0603]  (hidden comment: Capacitor)
C90  value 100nF  [0603]  (hidden comment: Capacitor)
C92  value 100nF  [0603]  (hidden comment: Capacitor)
C93  value 100nF  [0603]  (hidden comment: Capacitor)
C95  value 100nF  [0603]  (hidden comment: Capacitor)
C97  value 100nF  [0603]  (hidden comment: Capacitor)
C102  value 100nF  [0603]  (hidden comment: Capacitor)
C105  value 100nF  [0603]  (hidden comment: Capacitor)
C107  value 100nF  [0603]  (hidden comment: Capacitor)
C111  value 100nF  [0603]  (hidden comment: Capacitor)
C112  value 100nF  [0603]  (hidden comment: Capacitor)
C118  value 100nF  [0603]  (hidden comment: Capacitor)
C127  value 100nF  [0603]  (hidden comment: Capacitor)
C128  value 100nF  [0603]  (hidden comment: Capacitor)
C129  value 100nF  [0603]  (hidden comment: Capacitor)
C130  value 100nF  [0603]  (hidden comment: Capacitor)
C131  value 100nF  [0603]  (hidden comment: Capacitor)
C132  value 100nF  [0603]  (hidden comment: Capacitor)
C300  value 100nF  [0603]  (hidden comment: Capacitor)
C301  value 100nF  [0603]  (hidden comment: Capacitor)
L1  value 10uH  [IND_252012CDMC/DS]  (hidden comment: Inductor)
L2  value 2u2H  [IND_252012CDMC/DS]  (hidden comment: Inductor)
L5  value 2u2H  [IND_252012CDMC/DS]  (hidden comment: Inductor)
L7  value 100R  [0805]  (hidden comment: Ferrite)
L41  value 100R  [0805]  (hidden comment: Ferrite)
R19  value 10k  [0603]  (hidden comment: Resistor)
R20  value 18k  [0603]  (hidden comment: Resistor)
R23  value 5k6  [0603]  (hidden comment: Resistor)
R24  value 5k6  [0603]  (hidden comment: Resistor)
R27  value 4k7  [0603]  (hidden comment: Resistor)
R29  value 100k  [0603]  (hidden comment: Resistor)
R30  value 18k  [0603]  (hidden comment: Resistor)
R33  value 10k  [0603]  (hidden comment: Resistor)
R35  value 10k  [0603]  (hidden comment: Resistor)
R72  value 470R  [0603]  (hidden comment: Resistor)
R128  value 4R7  [0603]  (hidden comment: Resistor)
R300  value 100k  [0603]  (hidden comment: Resistor)
SW2  Button  [BUTTON_WS-TASV]  (value not drawn)
SW3  Button  [BUTTON_WS-TASV]  (value not drawn)
U4  Mfg_PN: XEF216-512-TQ128  [TQFP128_XMOS]  (part B of 5)
U5  ST1S06PUR  [DFN6_ST1S06]
U7  ST1S06PUR  [DFN6_ST1S06]
U10  MIC2774N-29YM5-TR  [SOT23_5]

### Blocks framed on the sheet
+3V3 supply for XMOS, ADC, DAC: C7-C9 C17 C58 L1 L2 L41 R19 R20 R23 R24 R72 U5
+1V0 supply for XMOS: C10 C12 C82 C300 L5 L7 R27 R29 R30 R300 U7
Power-on reset circuit: R33 R35 SW2 SW3 U10

### Ports
nPOR (out)

### Nets
+1V0: C76.1 C78.1 C79.1 C82.1 C90.1 C92.1 C93.1 C95.1 C102.1 C112.1 C127.1 C129.1 C131.1 L7.2 R33.1 R128.1 U4.11(VDD) U4.16(VDD) U4.17(VDD) U4.24(VDD) U4.36(VDD) U4.41(VDD) U4.49(USB_VDD) U4.56(VDD) U4.60(VDD) U4.73(VDD) U4.80(VDD) U4.81(VDD) U4.87(VDD) U4.101(VDD) U4.102(VDD) U4.120(VDD) U4.126(VDD)
+3V3: C58.1 C75.1 C77.1 C80.1 C97.1 C105.1 C107.1 C111.1 C128.1 C130.1 C132.1 C301.1 L1.2 R29.1 R72.1 U4.6(VDDIOL) U4.14(VDDIOL) U4.19(VDDIOL) U4.29(VDDIOL) U4.42(VDDIOL) U4.44(USB_VDD33) U4.52(VDDIOR) U4.67(VDDIOR) U4.78(VDDIOR) U4.83(VDDIOR) U4.92(VDDIOR) U4.105(OTP_VCC) U4.110(VDDIOT) U4.111(VDDIOT) U10.3(~{MR}) U10.5(VDD)
GND: C7.2 C8.2 C9.2 C10.2 C12.2 C17.2 C58.2 C75.2 C76.2 C77.2 C78.2 C79.2 C80.2 C82.2 C90.2 C92.2 C93.2 C95.2 C97.2 C102.2 C105.2 C107.2 C111.2 C112.2 C118.2 C127.2 C128.2 C129.2 C130.2 C131.2 C132.2 C300.2 C301.2 R23.2 R24.2 R30.2 R35.2 R300.2 SW2.2 SW3.2 U4.104(PLL_AGND) U4.129(GND) U5.2(GND) U5.PAD(GND) U7.2(GND) U7.PAD(GND) U10.2(GND)
VIN: C7.1 C10.1 R19.1 U5.4(VIN_SW) U5.5(VIN_A) U7.4(VIN_SW) U7.5(VIN_A)
NetC8_1: C8.1 R19.2 R23.1 U5.6(EN)
NetC9_1: C9.1 L2.2 L41.1 R20.1
NetC12_1: C12.1 L5.2 L7.1 R27.1
NetC17_1: C17.1 L1.1 L41.2 R72.2
NetC118_1: C118.1 R128.2 U4.103(PLL_AVDD)
NetC300_1: C300.1 R29.2 R300.1 U7.6(EN)
NetL2_1: L2.1 U5.3(SW)
NetL5_1: L5.1 U7.3(SW)
NetR20_2: R20.2 R24.1 U5.1(FB)
NetR27_2: R27.2 R30.1 U7.1(FB)
NetR33_2: R33.2 R35.1 U10.4(IN)
NetSW2_1: SW2.1 SW3.1 U10.1(~{RST}) ; port nPOR

Not connected (* = marked no-connect by the designer): SW2 3 4; SW3 3 4; U4 50(NC)* 65(NC)*

### Notes on the sheet
- Sheet name
- http://creativecommons.org
- Project name
- Contact
- Rev
- Date
- Sheet
- of
- (in symbol MIC2774N-29YM5-TR) -; +; 2V9; 0V3
- (in symbol XMOS_XEF216-512-TQ128, part B) POWER

### Library data of the parts
L1 = Inductor: Mfg: Murata; Mfg_PN: DFE252012F-100M=P2; HelpURL: *; NI: *; Rating: *; Tolerance: *; Supplier1: Digikey; Supplier1_PN: 490-13050-1-ND
L2 L5 = Inductor: Mfg: Murata; Mfg_PN: DFE252012F-2R2M=P2; HelpURL: *; NI: *; Rating: *; Tolerance: *; Supplier1: Digikey; Supplier1_PN: 490-13055-1-ND
L7 L41 = Ferrite: Rating: 1A; HelpURL: *; Mfg: *; Mfg_PN: *; NI: *; Supplier1: *; Supplier1_PN: *; Tolerance: *; Type: *
SW2 SW3 = Button: Mfg: Wurth; Mfg_PN: 430152050826; HelpURL: *; Rating: *; Tolerance: *; Value: *; Supplier1: Digikey; Supplier1_PN: 732-6993-1-ND
  SW2: NI: NI
  SW3: NI: *
U4 = XMOS_XEF216-512-TQ128: 32-bit multicore microcontroller. 2 Tiles. 16 Logical Cores. 512KB SRAM. 1000MIPS. TQFP128.; Mfg: XMOS; Supplier1: Digikey; Supplier1_PN: 880-1100-ND
U5 U7 = ST1S06PUR: DC-DC Buck Converter, 1.5A, 1.5MHz, DFN6; Mfg: ST Microelectronics; Mfg_PN: ST1S06PUR; Supplier1: Digikey; Supplier1_PN: 497-5802-1-ND
U10 = MIC2774N-29YM5-TR: Voltage supervisor and power-on timer, dual; Mfg: Micrel; HelpURL: *; Mfg_PN: MIC2774N-29YM5-TR; NI: *; Rating: *; Supplier1: Digikey; Supplier1_PN: 576-1101-1-ND; Tolerance: *; Type: *; Value: *
C7-C10 C12 C17 C58 C75-C80 C82 C90 C92 C93 C95 C97 C102 C105 C107 C111 C112 C118 C127-C132 C300 C301 = Capacitor: HelpURL: *; Mfg: *; Mfg_PN: *; NI: *; Supplier1: *; Supplier1_PN: *; Tolerance: *; Type: *; Rating: *
R19 R20 R23 R24 R27 R29 R30 R33 R35 R72 R128 R300 = Resistor: HelpURL: *; Mfg: *; Mfg_PN: *; NI: *; Supplier1: *; Supplier1_PN: *; Type: *; Rating: *; Tolerance: *